# Altium project Task Tyler.PrjPcb (part 1 of 3)
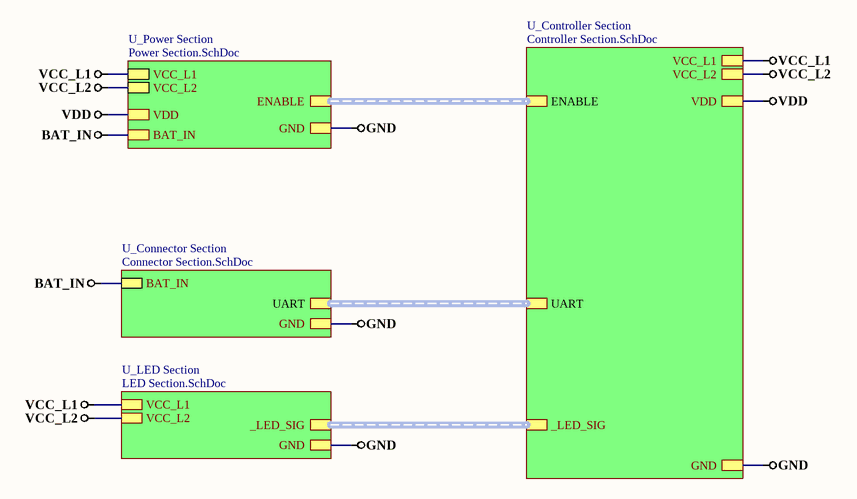
[diagram p0: Top Sheet.SchDoc]
33 sheets, 464 parts. Net scope: hierarchical (ports join the sheet entries above them; power ports are global).
Board files: Hotbuton_timer.PcbDoc, PCB_New.PcbDoc
Sheets:
  Top Sheet.SchDoc
    U_LED Section = LED Section.SchDoc
      U_Ring 1 = Ring 1.SchDoc
      U_Ring 2 = Ring 2.SchDoc
        U_Ring 2_A = Ring 2_A.SchDoc
        U_Ring 2_B = Ring 2_B.SchDoc
      U_Ring 3 = Ring 3.SchDoc
        U_Ring 3_B = Ring 3_B.SchDoc
        U_Ring 3_A = Ring 3_A.SchDoc
        U_Ring 3_C = Ring 3_C.SchDoc
      U_Ring 4 = Ring 4.SchDoc
        U_Ring 4_A = Ring 4_A.SchDoc
        U_Ring 4_B = Ring 4_B.SchDoc
        U_Ring 4_C = Ring 4_C.SchDoc
      U_Ring 5 = Ring 5.SchDoc
        U_Ring 5_A = Ring 5_A.SchDoc
        U_Ring 5_B = Ring 5_B.SchDoc
        U_Ring 5_C = Ring 5_C.SchDoc
        U_Ring 5_D = Ring 5_D.SchDoc
      U_Decoup_Cap 1 = Decoup_Cap 1.SchDoc
      U_Decoup_Cap 2 = Decoup_Cap 2.SchDoc
    U_Power Section = Power Section.SchDoc
      U_MCU_POWER = MCU_POWER.SchDoc
      U_LED_POWER = LED_POWER.SchDoc
      U_POWER_SWITCH = POWER_SWITCH.SchDoc
      U_SEC_POWER = SEC_POWER.SchDoc
      U_LED_POWER 2 = LED_POWER 2.SchDoc
    U_Controller Section = Controller Section.SchDoc
      U_MAIN_CONN = MAIN_CONN.SchDoc
      U_SOUND_SEC = SOUND_SEC.SchDoc
      U_LED_CONV_SIG = LED_CONV_SIG.SchDoc
      U_RTC_SEC = RTC_SEC.SchDoc
    U_Connector Section = Connector Section.SchDoc

## Sheet Top Sheet.SchDoc
size A; DocumentNumber: 1; SheetNumber: 1; SheetTotal: 30

### Sub-sheets
U_Connector Section = Connector Section.SchDoc: UART (harness Harness), BAT_IN, GND
U_Controller Section = Controller Section.SchDoc: ENABLE (harness Harness_2), UART (harness Harness), VCC_L2, VCC_L1, VDD, GND, _LED_SIG (harness Harness_8)
U_LED Section = LED Section.SchDoc: GND, VCC_L2, VCC_L1, _LED_SIG (harness Harness_8)
U_Power Section = Power Section.SchDoc: VCC_L1, VCC_L2, VDD, GND, ENABLE (harness Harness_2), BAT_IN

### Nets
BAT_IN: sheet U_Power Section/BAT_IN, sheet U_Connector Section/BAT_IN
GND: sheet U_LED Section/GND, sheet U_Power Section/GND, sheet U_Controller Section/GND, sheet U_Connector Section/GND
VCC_L1: sheet U_LED Section/VCC_L1, sheet U_Power Section/VCC_L1, sheet U_Controller Section/VCC_L1
VCC_L2: sheet U_LED Section/VCC_L2, sheet U_Power Section/VCC_L2, sheet U_Controller Section/VCC_L2
VDD: sheet U_Power Section/VDD, sheet U_Controller Section/VDD

### Buses and harness runs
harness sheet U_Connector Section/UART = sheet U_Controller Section/UART
harness sheet U_Controller Section/_LED_SIG = sheet U_LED Section/_LED_SIG
harness sheet U_Controller Section/ENABLE = sheet U_Power Section/ENABLE

## Sheet LED Section.SchDoc
size A; DocumentNumber: 6; SheetNumber: 8; SheetTotal: 30
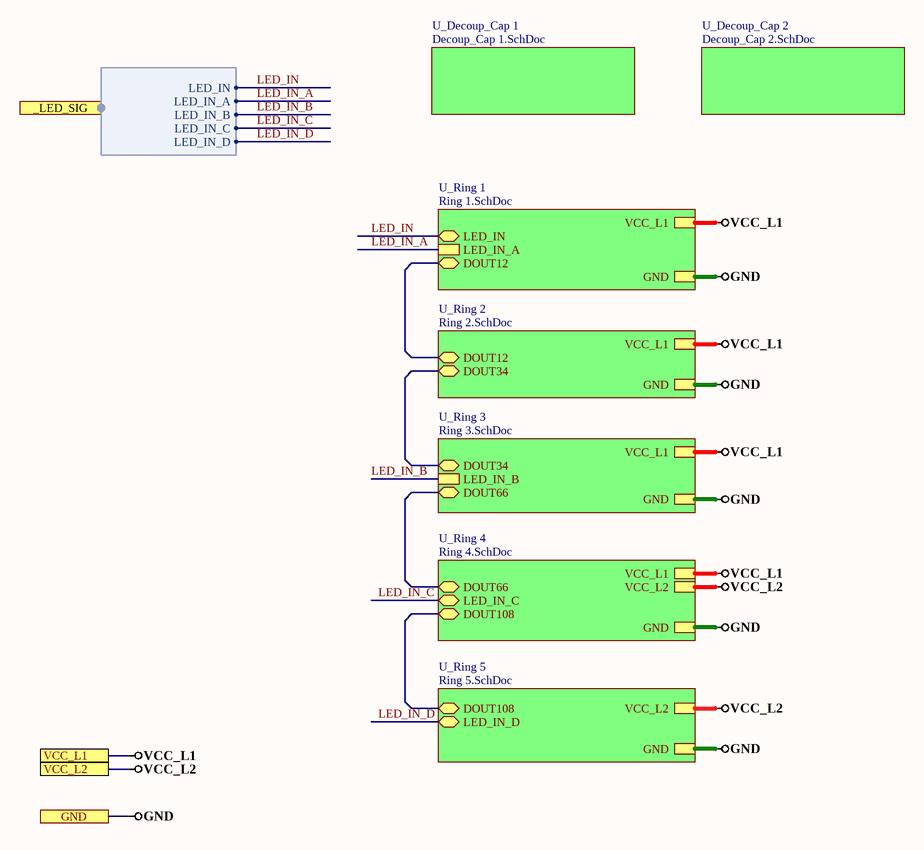
[diagram p1: LED Section.SchDoc]

### Sub-sheets
U_Decoup_Cap 1 = Decoup_Cap 1.SchDoc: no entries
U_Decoup_Cap 2 = Decoup_Cap 2.SchDoc: no entries
U_Ring 1 = Ring 1.SchDoc: DOUT12 (bidir), LED_IN (bidir), LED_IN_A, GND, VCC_L1
U_Ring 2 = Ring 2.SchDoc: DOUT12 (bidir), DOUT34 (bidir), GND, VCC_L1
U_Ring 3 = Ring 3.SchDoc: DOUT34 (bidir), DOUT66 (bidir), GND, VCC_L1, LED_IN_B
U_Ring 4 = Ring 4.SchDoc: DOUT108 (bidir), DOUT66 (bidir), GND, VCC_L2, VCC_L1, LED_IN_C (bidir)
U_Ring 5 = Ring 5.SchDoc: DOUT108 (bidir), GND, VCC_L2, LED_IN_D (bidir)

### Ports
_LED_SIG (harness Harness_8), GND, VCC_L1, VCC_L2

### Harnesses
Harness_8: LED_IN, LED_IN_A, LED_IN_B, LED_IN_C, LED_IN_D

### Nets
GND: port GND, sheet U_Ring 1/GND, sheet U_Ring 2/GND, sheet U_Ring 3/GND, sheet U_Ring 4/GND, sheet U_Ring 5/GND
VCC_L1: port VCC_L1, sheet U_Ring 1/VCC_L1, sheet U_Ring 2/VCC_L1, sheet U_Ring 3/VCC_L1, sheet U_Ring 4/VCC_L1
VCC_L2: port VCC_L2, sheet U_Ring 4/VCC_L2, sheet U_Ring 5/VCC_L2
DOUT12: sheet U_Ring 1/DOUT12, sheet U_Ring 2/DOUT12
DOUT34: sheet U_Ring 2/DOUT34, sheet U_Ring 3/DOUT34
DOUT66: sheet U_Ring 3/DOUT66, sheet U_Ring 4/DOUT66
DOUT108: sheet U_Ring 4/DOUT108, sheet U_Ring 5/DOUT108
LED_IN: sheet U_Ring 1/LED_IN, port _LED_SIG.LED_IN
LED_IN_A: sheet U_Ring 1/LED_IN_A, port _LED_SIG.LED_IN_A
LED_IN_B: sheet U_Ring 3/LED_IN_B, port _LED_SIG.LED_IN_B
LED_IN_C: sheet U_Ring 4/LED_IN_C, port _LED_SIG.LED_IN_C
LED_IN_D: sheet U_Ring 5/LED_IN_D, port _LED_SIG.LED_IN_D

## Sheet Ring 1.SchDoc
size A; DocumentNumber: 7; SheetNumber: 9; SheetTotal: 30
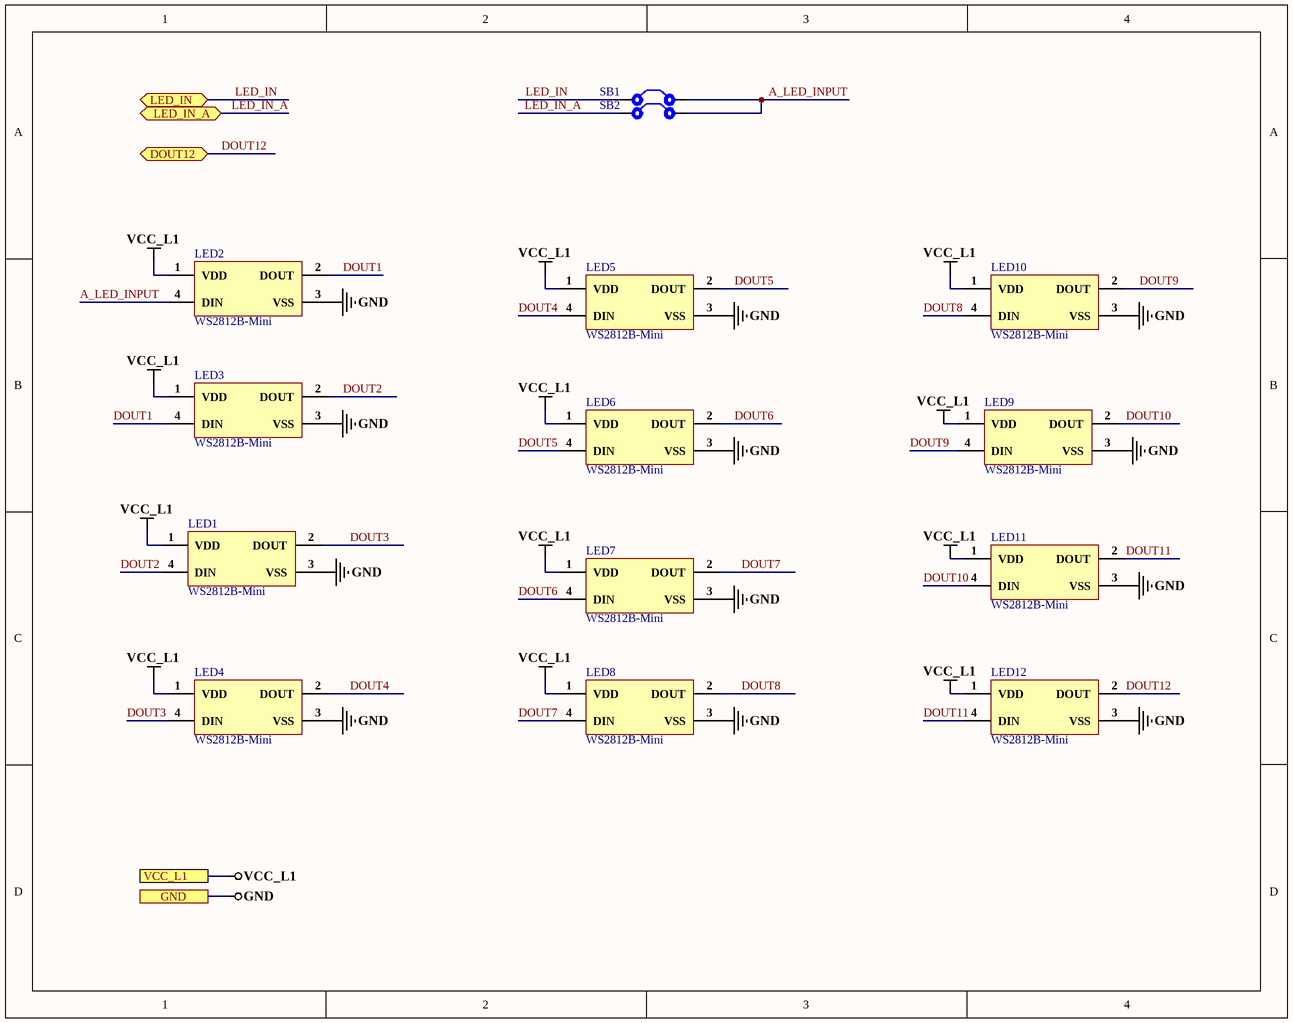
[diagram p2: Ring 1.SchDoc]

### Parts
LED1  WS2812B-Mini  [WS2812B-Mini]
LED2  WS2812B-Mini  [WS2812B-Mini]
LED3  WS2812B-Mini  [WS2812B-Mini]
LED4  WS2812B-Mini  [WS2812B-Mini]
LED5  WS2812B-Mini  [WS2812B-Mini]
LED6  WS2812B-Mini  [WS2812B-Mini]
LED7  WS2812B-Mini  [WS2812B-Mini]
LED8  WS2812B-Mini  [WS2812B-Mini]
LED9  WS2812B-Mini  [WS2812B-Mini]
LED10  WS2812B-Mini  [WS2812B-Mini]
LED11  WS2812B-Mini  [WS2812B-Mini]
LED12  WS2812B-Mini  [WS2812B-Mini]
SB1  Solder Bridge  [Solder Bridge]  (value not drawn)
SB2  Solder Bridge  [Solder Bridge]  (value not drawn)

### Ports
DOUT12 (bidir), GND, LED_IN (bidir), LED_IN_A (bidir), VCC_L1

### Nets
GND: LED1.3(VSS) LED2.3(VSS) LED3.3(VSS) LED4.3(VSS) LED5.3(VSS) LED6.3(VSS) LED7.3(VSS) LED8.3(VSS) LED9.3(VSS) LED10.3(VSS) LED11.3(VSS) LED12.3(VSS) ; port GND
VCC_L1: LED1.1(VDD) LED2.1(VDD) LED3.1(VDD) LED4.1(VDD) LED5.1(VDD) LED6.1(VDD) LED7.1(VDD) LED8.1(VDD) LED9.1(VDD) LED10.1(VDD) LED11.1(VDD) LED12.1(VDD) ; port VCC_L1
A_LED_INPUT: LED2.4(DIN) SB1.2 SB2.2
DOUT1: LED2.2(DOUT) LED3.4(DIN)
DOUT2: LED1.4(DIN) LED3.2(DOUT)
DOUT3: LED1.2(DOUT) LED4.4(DIN)
DOUT4: LED4.2(DOUT) LED5.4(DIN)
DOUT5: LED5.2(DOUT) LED6.4(DIN)
DOUT6: LED6.2(DOUT) LED7.4(DIN)
DOUT7: LED7.2(DOUT) LED8.4(DIN)
DOUT8: LED8.2(DOUT) LED10.4(DIN)
DOUT9: LED9.4(DIN) LED10.2(DOUT)
DOUT10: LED9.2(DOUT) LED11.4(DIN)
DOUT11: LED11.2(DOUT) LED12.4(DIN)
DOUT12: LED12.2(DOUT) ; port DOUT12
LED_IN: SB1.1 ; port LED_IN
LED_IN_A: SB2.1 ; port LED_IN_A

### Library data of the parts
LED1-LED12 = WS2812B-Mini: SMD,3.5x3.5mm Light Emitting Diodes (LED) RoHS; Manufacturer: Worldsemi; ComponentLink1Description: LCSC; ComponentLink1URL: *https://lcsc.com/product-detail/Light-Emitting-Diodes-LED_Worldsemi-WS2812B-Mini_C527089.html; Package: SMD,3.5x3.5mm; Parameter 1: *
SB1 SB2 = Solder Bridge: Solder Bridge ON

## Sheet Ring 2.SchDoc
size A; SheetNumber: 10; SheetTotal: 30
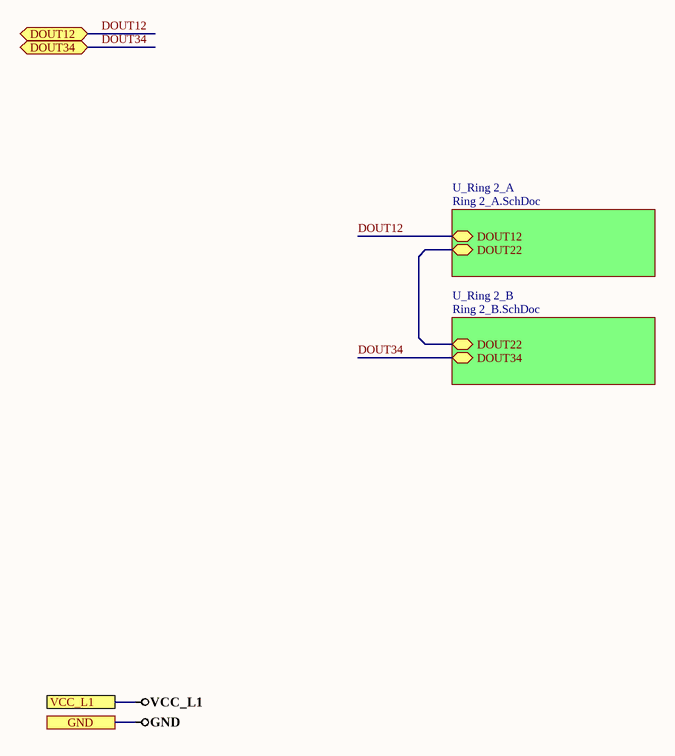
[diagram p3: Ring 2.SchDoc]

### Sub-sheets
U_Ring 2_A = Ring 2_A.SchDoc: DOUT22 (bidir), DOUT12 (bidir)
U_Ring 2_B = Ring 2_B.SchDoc: DOUT22 (bidir), DOUT34 (bidir)

### Ports
DOUT12 (bidir), DOUT34 (bidir), GND, VCC_L1

### Nets
DOUT12: port DOUT12, sheet U_Ring 2_A/DOUT12
DOUT22: sheet U_Ring 2_A/DOUT22, sheet U_Ring 2_B/DOUT22
DOUT34: port DOUT34, sheet U_Ring 2_B/DOUT34

## Sheet Ring 2_A.SchDoc
size A; SheetNumber: 11; SheetTotal: 30
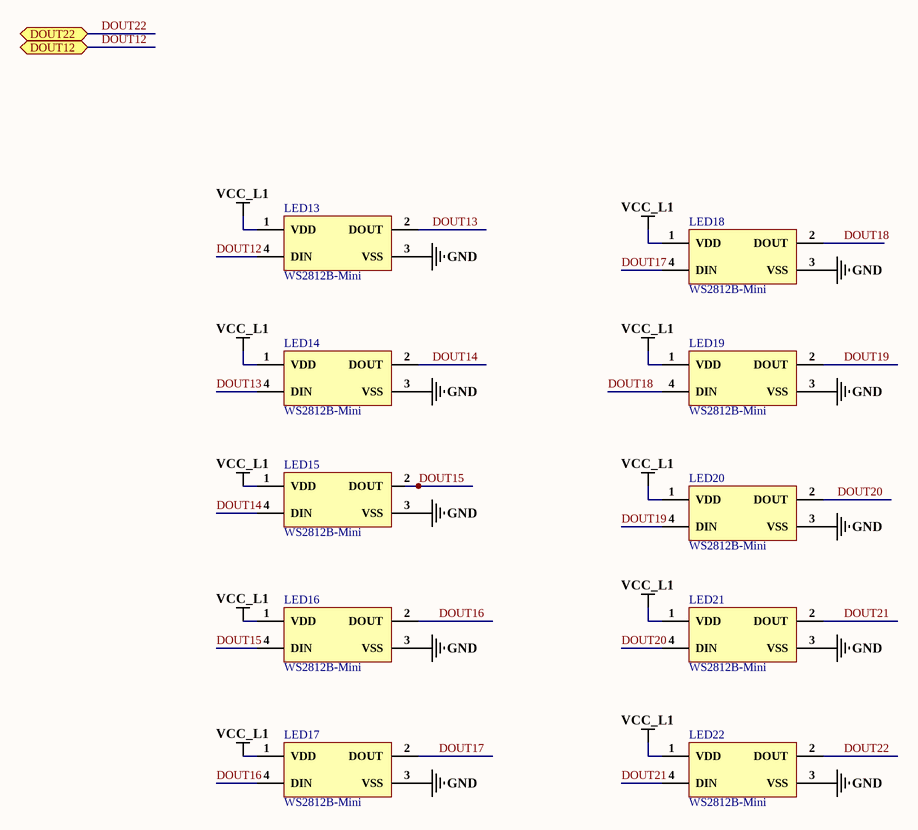
[diagram p4: Ring 2_A.SchDoc]

### Parts
LED13  WS2812B-Mini  [WS2812B-Mini]
LED14  WS2812B-Mini  [WS2812B-Mini]
LED15  WS2812B-Mini  [WS2812B-Mini]
LED16  WS2812B-Mini  [WS2812B-Mini]
LED17  WS2812B-Mini  [WS2812B-Mini]
LED18  WS2812B-Mini  [WS2812B-Mini]
LED19  WS2812B-Mini  [WS2812B-Mini]
LED20  WS2812B-Mini  [WS2812B-Mini]
LED21  WS2812B-Mini  [WS2812B-Mini]
LED22  WS2812B-Mini  [WS2812B-Mini]

### Ports
DOUT12 (bidir), DOUT22 (bidir)

### Nets
GND: LED13.3(VSS) LED14.3(VSS) LED15.3(VSS) LED16.3(VSS) LED17.3(VSS) LED18.3(VSS) LED19.3(VSS) LED20.3(VSS) LED21.3(VSS) LED22.3(VSS)
VCC_L1: LED13.1(VDD) LED14.1(VDD) LED15.1(VDD) LED16.1(VDD) LED17.1(VDD) LED18.1(VDD) LED19.1(VDD) LED20.1(VDD) LED21.1(VDD) LED22.1(VDD)
DOUT12: LED13.4(DIN) ; port DOUT12
DOUT13: LED13.2(DOUT) LED14.4(DIN)
DOUT14: LED14.2(DOUT) LED15.4(DIN)
DOUT15: LED15.2(DOUT) LED16.4(DIN)
DOUT16: LED16.2(DOUT) LED17.4(DIN)
DOUT17: LED17.2(DOUT) LED18.4(DIN)
DOUT18: LED18.2(DOUT) LED19.4(DIN)
DOUT19: LED19.2(DOUT) LED20.4(DIN)
DOUT20: LED20.2(DOUT) LED21.4(DIN)
DOUT21: LED21.2(DOUT) LED22.4(DIN)
DOUT22: LED22.2(DOUT) ; port DOUT22

### Library data of the parts
LED13-LED22 = WS2812B-Mini: as LED1 on sheet Ring 1; ComponentLink1Description: LCSC; ComponentLink1URL: *https://lcsc.com/product-detail/Light-Emitting-Diodes-LED_Worldsemi-WS2812B-Mini_C527089.html; Package: SMD,3.5x3.5mm; Parameter 1: *

## Sheet Ring 2_B.SchDoc
size A; DocumentNumber: 8; SheetNumber: 12; SheetTotal: 30
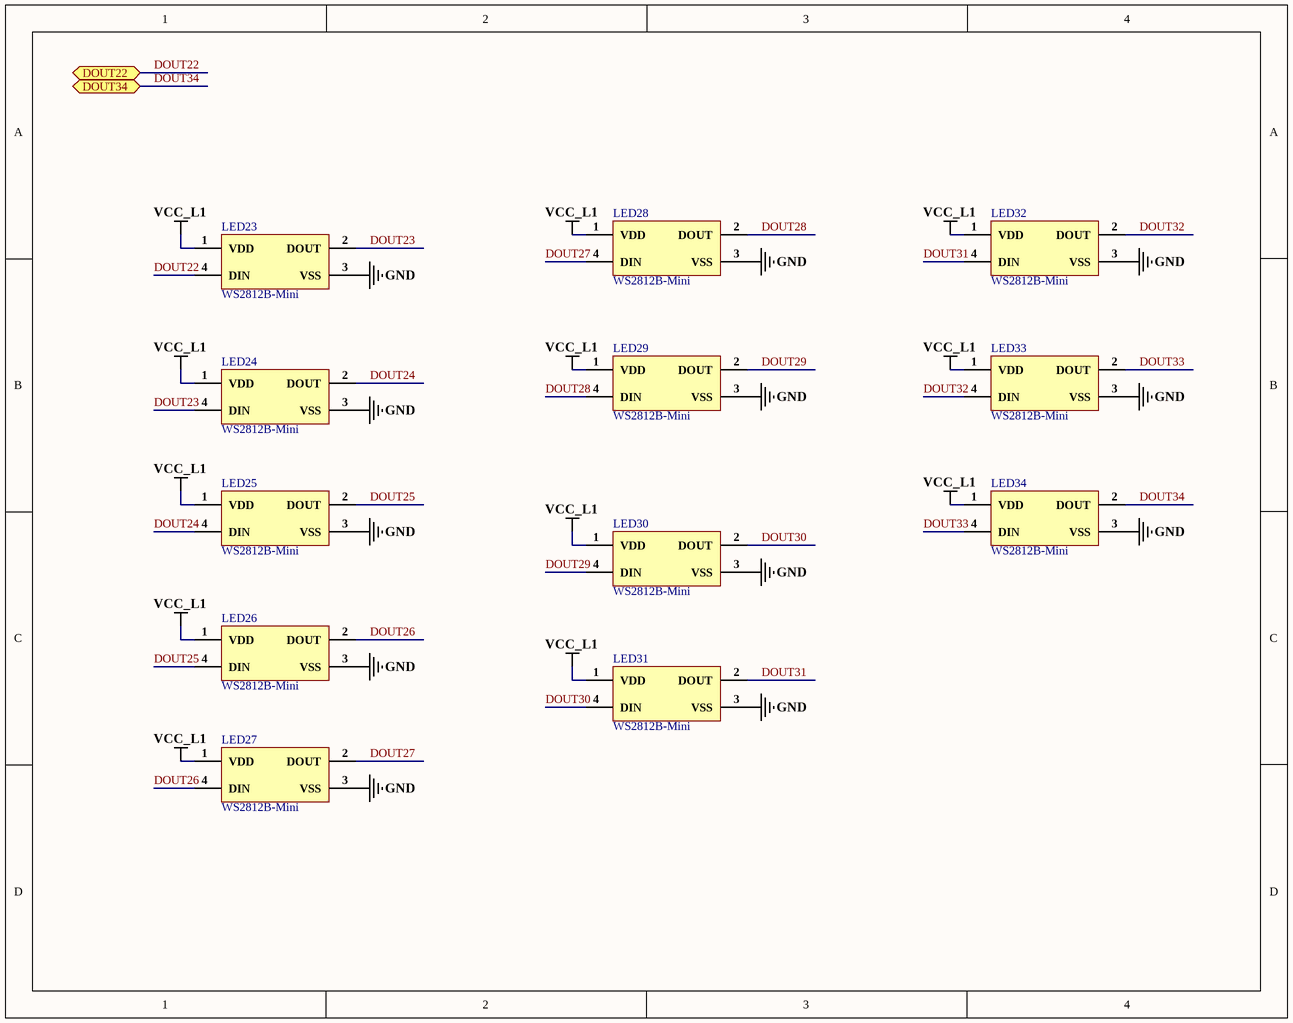
[diagram p5: Ring 2_B.SchDoc]

### Parts
LED23  WS2812B-Mini  [WS2812B-Mini]
LED24  WS2812B-Mini  [WS2812B-Mini]
LED25  WS2812B-Mini  [WS2812B-Mini]
LED26  WS2812B-Mini  [WS2812B-Mini]
LED27  WS2812B-Mini  [WS2812B-Mini]
LED28  WS2812B-Mini  [WS2812B-Mini]
LED29  WS2812B-Mini  [WS2812B-Mini]
LED30  WS2812B-Mini  [WS2812B-Mini]
LED31  WS2812B-Mini  [WS2812B-Mini]
LED32  WS2812B-Mini  [WS2812B-Mini]
LED33  WS2812B-Mini  [WS2812B-Mini]
LED34  WS2812B-Mini  [WS2812B-Mini]

### Ports
DOUT22 (bidir), DOUT34 (bidir)

### Nets
GND: LED23.3(VSS) LED24.3(VSS) LED25.3(VSS) LED26.3(VSS) LED27.3(VSS) LED28.3(VSS) LED29.3(VSS) LED30.3(VSS) LED31.3(VSS) LED32.3(VSS) LED33.3(VSS) LED34.3(VSS)
VCC_L1: LED23.1(VDD) LED24.1(VDD) LED25.1(VDD) LED26.1(VDD) LED27.1(VDD) LED28.1(VDD) LED29.1(VDD) LED30.1(VDD) LED31.1(VDD) LED32.1(VDD) LED33.1(VDD) LED34.1(VDD)
DOUT22: LED23.4(DIN) ; port DOUT22
DOUT23: LED23.2(DOUT) LED24.4(DIN)
DOUT24: LED24.2(DOUT) LED25.4(DIN)
DOUT25: LED25.2(DOUT) LED26.4(DIN)
DOUT26: LED26.2(DOUT) LED27.4(DIN)
DOUT27: LED27.2(DOUT) LED28.4(DIN)
DOUT28: LED28.2(DOUT) LED29.4(DIN)
DOUT29: LED29.2(DOUT) LED30.4(DIN)
DOUT30: LED30.2(DOUT) LED31.4(DIN)
DOUT31: LED31.2(DOUT) LED32.4(DIN)
DOUT32: LED32.2(DOUT) LED33.4(DIN)
DOUT33: LED33.2(DOUT) LED34.4(DIN)
DOUT34: LED34.2(DOUT) ; port DOUT34

### Library data of the parts
LED23-LED34 = WS2812B-Mini: as LED1 on sheet Ring 1; ComponentLink1Description: LCSC; ComponentLink1URL: *https://lcsc.com/product-detail/Light-Emitting-Diodes-LED_Worldsemi-WS2812B-Mini_C527089.html; Package: SMD,3.5x3.5mm; Parameter 1: *

## Sheet Ring 3.SchDoc
size A; SheetNumber: 13; SheetTotal: 30
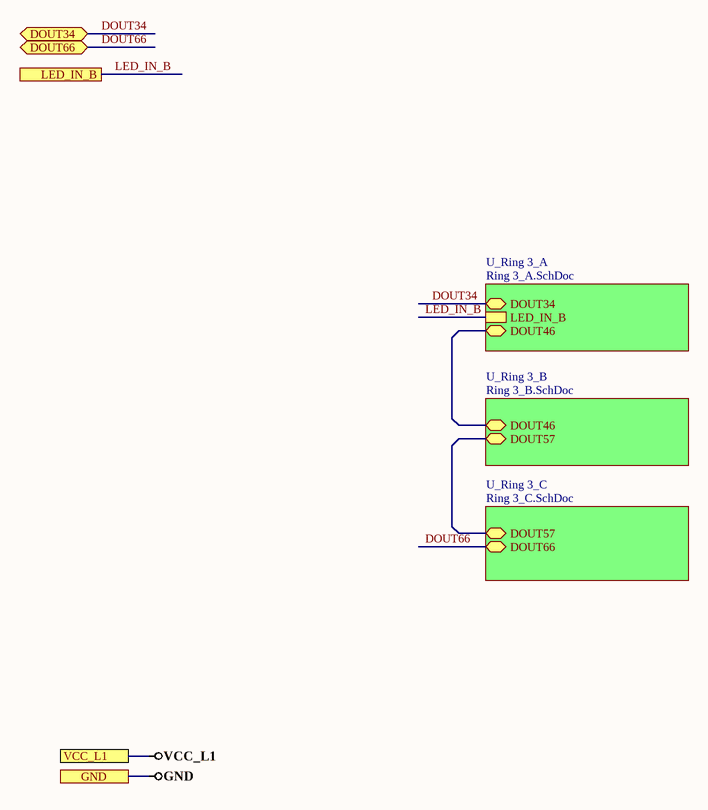
[diagram p6: Ring 3.SchDoc]

### Sub-sheets
U_Ring 3_A = Ring 3_A.SchDoc: DOUT34 (bidir), DOUT46 (bidir), LED_IN_B
U_Ring 3_B = Ring 3_B.SchDoc: DOUT57 (bidir), DOUT46 (bidir)
U_Ring 3_C = Ring 3_C.SchDoc: DOUT66 (bidir), DOUT57 (bidir)

### Ports
DOUT34 (bidir), DOUT66 (bidir), GND, LED_IN_B, VCC_L1

### Nets
DOUT34: port DOUT34, sheet U_Ring 3_A/DOUT34
DOUT46: sheet U_Ring 3_B/DOUT46, sheet U_Ring 3_A/DOUT46
DOUT57: sheet U_Ring 3_B/DOUT57, sheet U_Ring 3_C/DOUT57
DOUT66: port DOUT66, sheet U_Ring 3_C/DOUT66
LED_IN_B: port LED_IN_B, sheet U_Ring 3_A/LED_IN_B

## Sheet Ring 3_B.SchDoc
size A; SheetNumber: 15; SheetTotal: 30
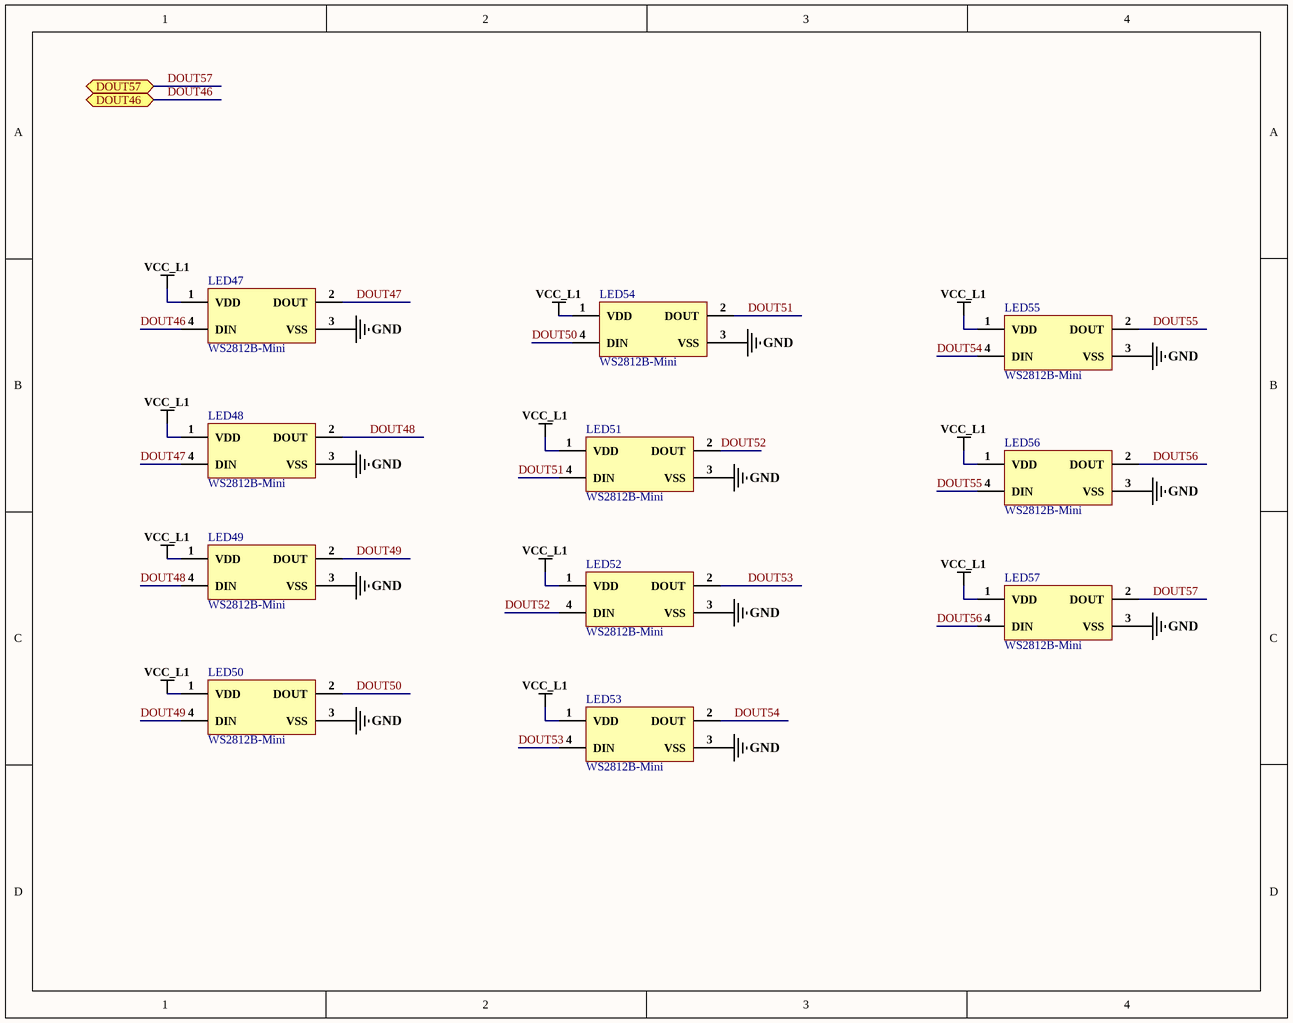
[diagram p7: Ring 3_B.SchDoc]

### Parts
LED47  WS2812B-Mini  [WS2812B-Mini]
LED48  WS2812B-Mini  [WS2812B-Mini]
LED49  WS2812B-Mini  [WS2812B-Mini]
LED50  WS2812B-Mini  [WS2812B-Mini]
LED51  WS2812B-Mini  [WS2812B-Mini]
LED52  WS2812B-Mini  [WS2812B-Mini]
LED53  WS2812B-Mini  [WS2812B-Mini]
LED54  WS2812B-Mini  [WS2812B-Mini]
LED55  WS2812B-Mini  [WS2812B-Mini]
LED56  WS2812B-Mini  [WS2812B-Mini]
LED57  WS2812B-Mini  [WS2812B-Mini]

### Ports
DOUT46 (bidir), DOUT57 (bidir)

### Nets
GND: LED47.3(VSS) LED48.3(VSS) LED49.3(VSS) LED50.3(VSS) LED51.3(VSS) LED52.3(VSS) LED53.3(VSS) LED54.3(VSS) LED55.3(VSS) LED56.3(VSS) LED57.3(VSS)
VCC_L1: LED47.1(VDD) LED48.1(VDD) LED49.1(VDD) LED50.1(VDD) LED51.1(VDD) LED52.1(VDD) LED53.1(VDD) LED54.1(VDD) LED55.1(VDD) LED56.1(VDD) LED57.1(VDD)
DOUT46: LED47.4(DIN) ; port DOUT46
DOUT47: LED47.2(DOUT) LED48.4(DIN)
DOUT48: LED48.2(DOUT) LED49.4(DIN)
DOUT49: LED49.2(DOUT) LED50.4(DIN)
DOUT50: LED50.2(DOUT) LED54.4(DIN)
DOUT51: LED51.4(DIN) LED54.2(DOUT)
DOUT52: LED51.2(DOUT) LED52.4(DIN)
DOUT53: LED52.2(DOUT) LED53.4(DIN)
DOUT54: LED53.2(DOUT) LED55.4(DIN)
DOUT55: LED55.2(DOUT) LED56.4(DIN)
DOUT56: LED56.2(DOUT) LED57.4(DIN)
DOUT57: LED57.2(DOUT) ; port DOUT57

### Library data of the parts
LED47-LED57 = WS2812B-Mini: as LED1 on sheet Ring 1; ComponentLink1Description: LCSC; ComponentLink1URL: *https://lcsc.com/product-detail/Light-Emitting-Diodes-LED_Worldsemi-WS2812B-Mini_C527089.html; Package: SMD,3.5x3.5mm; Parameter 1: *

## Sheet Ring 3_A.SchDoc
size A; DocumentNumber: 9; SheetNumber: 14; SheetTotal: 30
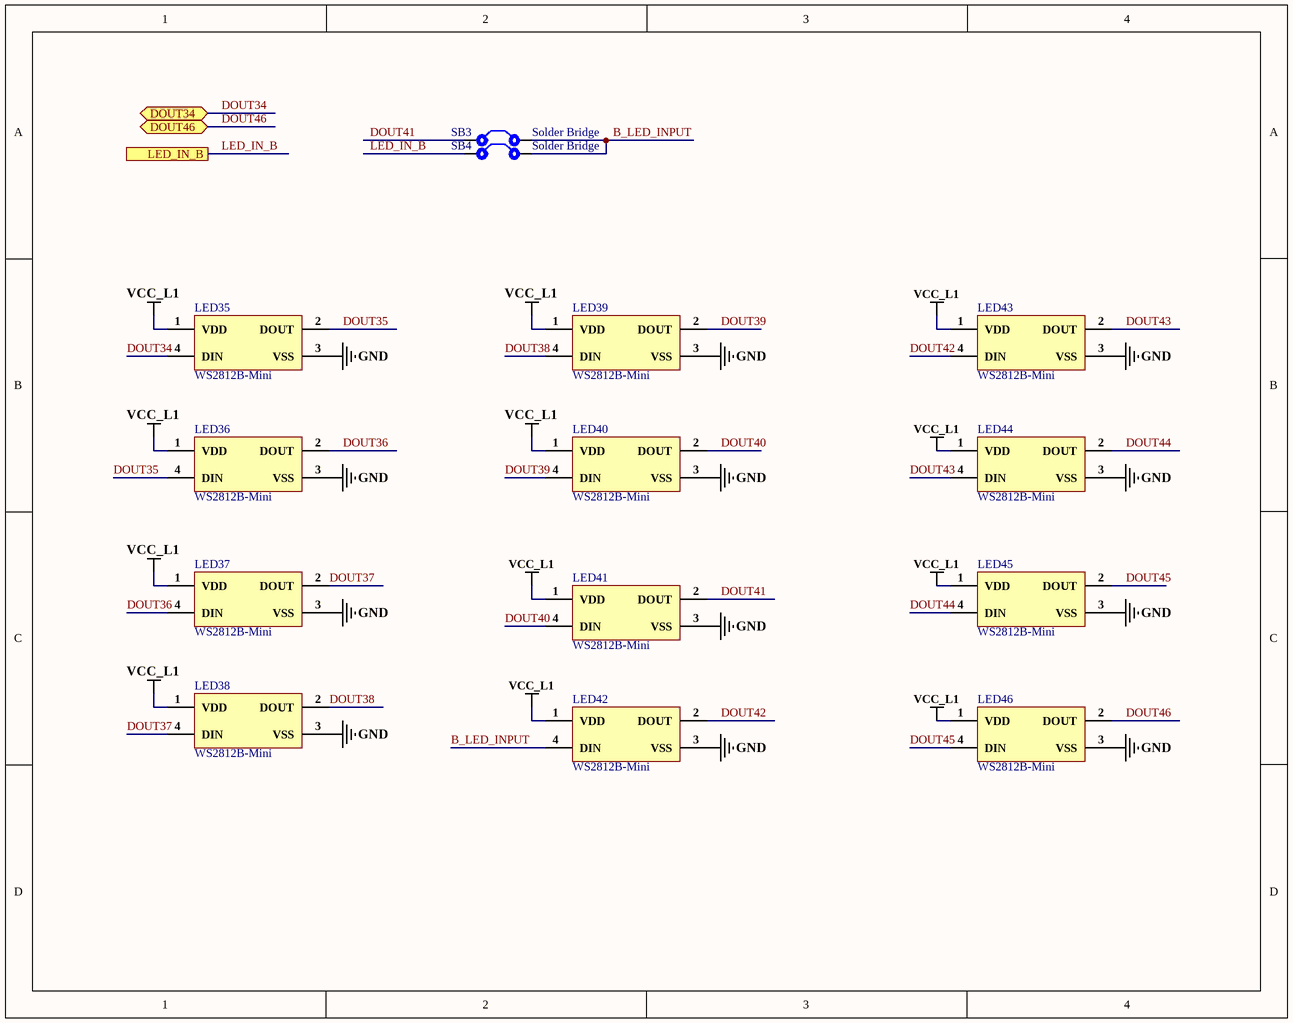
[diagram p8: Ring 3_A.SchDoc]

### Parts
(Parts that share a designator on the sheet are numbered #1, #2 ... from top to bottom, then left to right.)
LED35  WS2812B-Mini  [WS2812B-Mini]
LED36  WS2812B-Mini  [WS2812B-Mini]
LED37  WS2812B-Mini  [WS2812B-Mini]
LED38  WS2812B-Mini  [WS2812B-Mini]
LED39  WS2812B-Mini  [WS2812B-Mini]
LED40  WS2812B-Mini  [WS2812B-Mini]
LED41  WS2812B-Mini  [WS2812B-Mini]
LED42  WS2812B-Mini  [WS2812B-Mini]
LED43  WS2812B-Mini  [WS2812B-Mini]
LED44  WS2812B-Mini  [WS2812B-Mini]
LED45  WS2812B-Mini  [WS2812B-Mini]
LED46  WS2812B-Mini  [WS2812B-Mini]
SB3#1  Solder Bridge  [Solder Bridge]
SB4#1  Solder Bridge  [Solder Bridge]

### Ports
DOUT34 (bidir), DOUT46 (bidir), LED_IN_B

### Nets
GND: LED35.3(VSS) LED36.3(VSS) LED37.3(VSS) LED38.3(VSS) LED39.3(VSS) LED40.3(VSS) LED41.3(VSS) LED42.3(VSS) LED43.3(VSS) LED44.3(VSS) LED45.3(VSS) LED46.3(VSS)
VCC_L1: LED35.1(VDD) LED36.1(VDD) LED37.1(VDD) LED38.1(VDD) LED39.1(VDD) LED40.1(VDD) LED41.1(VDD) LED42.1(VDD) LED43.1(VDD) LED44.1(VDD) LED45.1(VDD) LED46.1(VDD)
B_LED_INPUT: LED42.4(DIN) SB3#1.2 SB4#1.2
DOUT34: LED35.4(DIN) ; port DOUT34
DOUT35: LED35.2(DOUT) LED36.4(DIN)
DOUT36: LED36.2(DOUT) LED37.4(DIN)
DOUT37: LED37.2(DOUT) LED38.4(DIN)
DOUT38: LED38.2(DOUT) LED39.4(DIN)
DOUT39: LED39.2(DOUT) LED40.4(DIN)
DOUT40: LED40.2(DOUT) LED41.4(DIN)
DOUT41: LED41.2(DOUT) SB3#1.1
DOUT42: LED42.2(DOUT) LED43.4(DIN)
DOUT43: LED43.2(DOUT) LED44.4(DIN)
DOUT44: LED44.2(DOUT) LED45.4(DIN)
DOUT45: LED45.2(DOUT) LED46.4(DIN)
DOUT46: LED46.2(DOUT) ; port DOUT46
LED_IN_B: SB4#1.1 ; port LED_IN_B

### Library data of the parts
LED35-LED46 = WS2812B-Mini: as LED1 on sheet Ring 1; ComponentLink1Description: LCSC; ComponentLink1URL: *https://lcsc.com/product-detail/Light-Emitting-Diodes-LED_Worldsemi-WS2812B-Mini_C527089.html; Package: SMD,3.5x3.5mm; Parameter 1: *
SB3#1 SB4#1 = Solder Bridge: Solder Bridge ON

## Sheet Ring 3_C.SchDoc
size A; DocumentNumber: 10; SheetNumber: 16; SheetTotal: 30
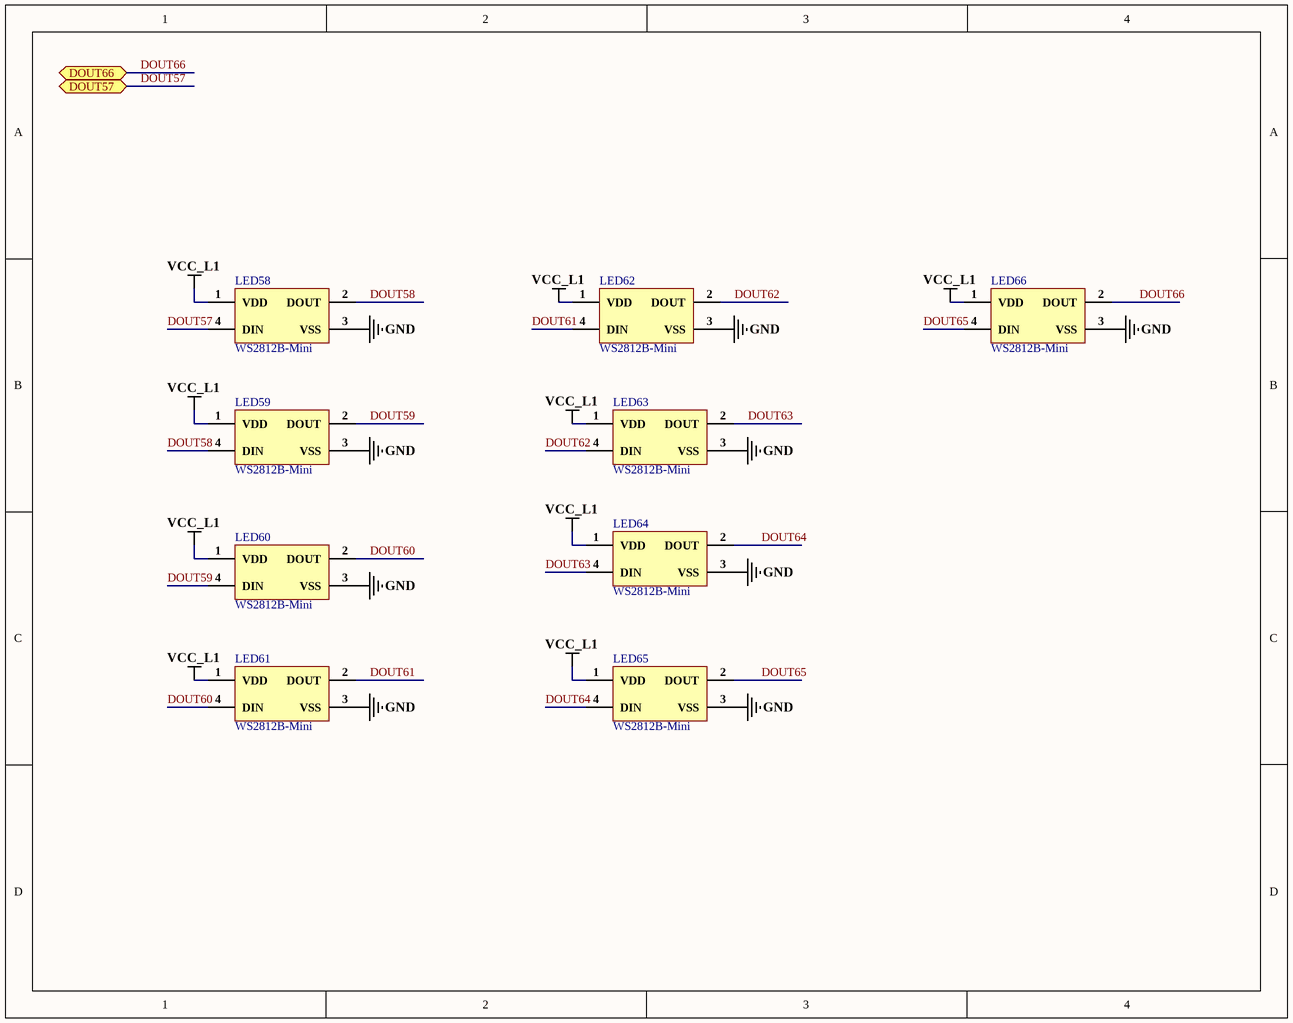
[diagram p9: Ring 3_C.SchDoc]

### Parts
LED58  WS2812B-Mini  [WS2812B-Mini]
LED59  WS2812B-Mini  [WS2812B-Mini]
LED60  WS2812B-Mini  [WS2812B-Mini]
LED61  WS2812B-Mini  [WS2812B-Mini]
LED62  WS2812B-Mini  [WS2812B-Mini]
LED63  WS2812B-Mini  [WS2812B-Mini]
LED64  WS2812B-Mini  [WS2812B-Mini]
LED65  WS2812B-Mini  [WS2812B-Mini]
LED66  WS2812B-Mini  [WS2812B-Mini]

### Ports
DOUT57 (bidir), DOUT66 (bidir)

### Nets
GND: LED58.3(VSS) LED59.3(VSS) LED60.3(VSS) LED61.3(VSS) LED62.3(VSS) LED63.3(VSS) LED64.3(VSS) LED65.3(VSS) LED66.3(VSS)
VCC_L1: LED58.1(VDD) LED59.1(VDD) LED60.1(VDD) LED61.1(VDD) LED62.1(VDD) LED63.1(VDD) LED64.1(VDD) LED65.1(VDD) LED66.1(VDD)
DOUT57: LED58.4(DIN) ; port DOUT57
DOUT58: LED58.2(DOUT) LED59.4(DIN)
DOUT59: LED59.2(DOUT) LED60.4(DIN)
DOUT60: LED60.2(DOUT) LED61.4(DIN)
DOUT61: LED61.2(DOUT) LED62.4(DIN)
DOUT62: LED62.2(DOUT) LED63.4(DIN)
DOUT63: LED63.2(DOUT) LED64.4(DIN)
DOUT64: LED64.2(DOUT) LED65.4(DIN)
DOUT65: LED65.2(DOUT) LED66.4(DIN)
DOUT66: LED66.2(DOUT) ; port DOUT66

### Library data of the parts
LED58-LED66 = WS2812B-Mini: as LED1 on sheet Ring 1; ComponentLink1Description: LCSC; ComponentLink1URL: *https://lcsc.com/product-detail/Light-Emitting-Diodes-LED_Worldsemi-WS2812B-Mini_C527089.html; Package: SMD,3.5x3.5mm; Parameter 1: *

## Sheet Ring 4.SchDoc
size A; SheetNumber: 17; SheetTotal: 30
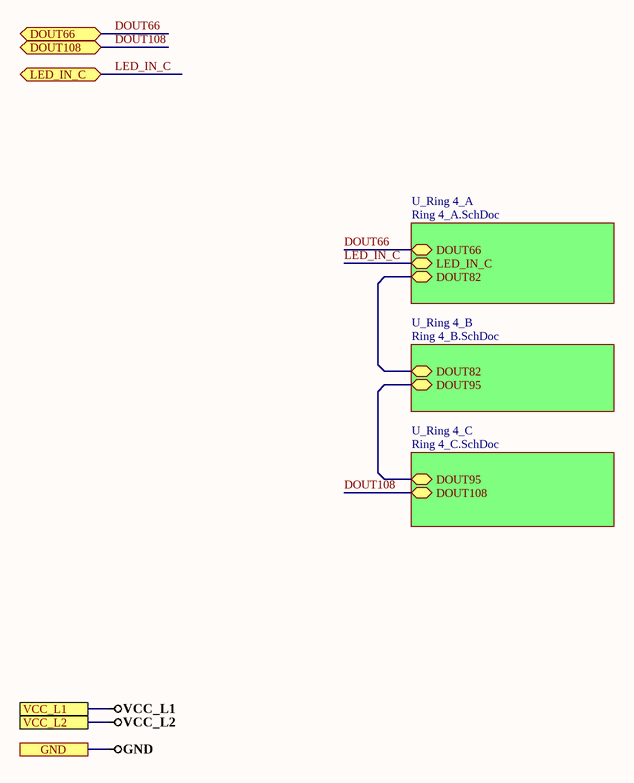
[diagram p10: Ring 4.SchDoc]

### Sub-sheets
U_Ring 4_A = Ring 4_A.SchDoc: DOUT66 (bidir), DOUT82 (bidir), LED_IN_C (bidir)
U_Ring 4_B = Ring 4_B.SchDoc: DOUT82 (bidir), DOUT95 (bidir)
U_Ring 4_C = Ring 4_C.SchDoc: DOUT95 (bidir), DOUT108 (bidir)

### Ports
DOUT66 (bidir), DOUT108 (bidir), GND, LED_IN_C (bidir), VCC_L1, VCC_L2

### Nets
DOUT66: port DOUT66, sheet U_Ring 4_A/DOUT66
DOUT82: sheet U_Ring 4_A/DOUT82, sheet U_Ring 4_B/DOUT82
DOUT95: sheet U_Ring 4_B/DOUT95, sheet U_Ring 4_C/DOUT95
DOUT108: port DOUT108, sheet U_Ring 4_C/DOUT108
LED_IN_C: port LED_IN_C, sheet U_Ring 4_A/LED_IN_C

## Sheet Ring 4_A.SchDoc
size A; SheetNumber: 18; SheetTotal: 30
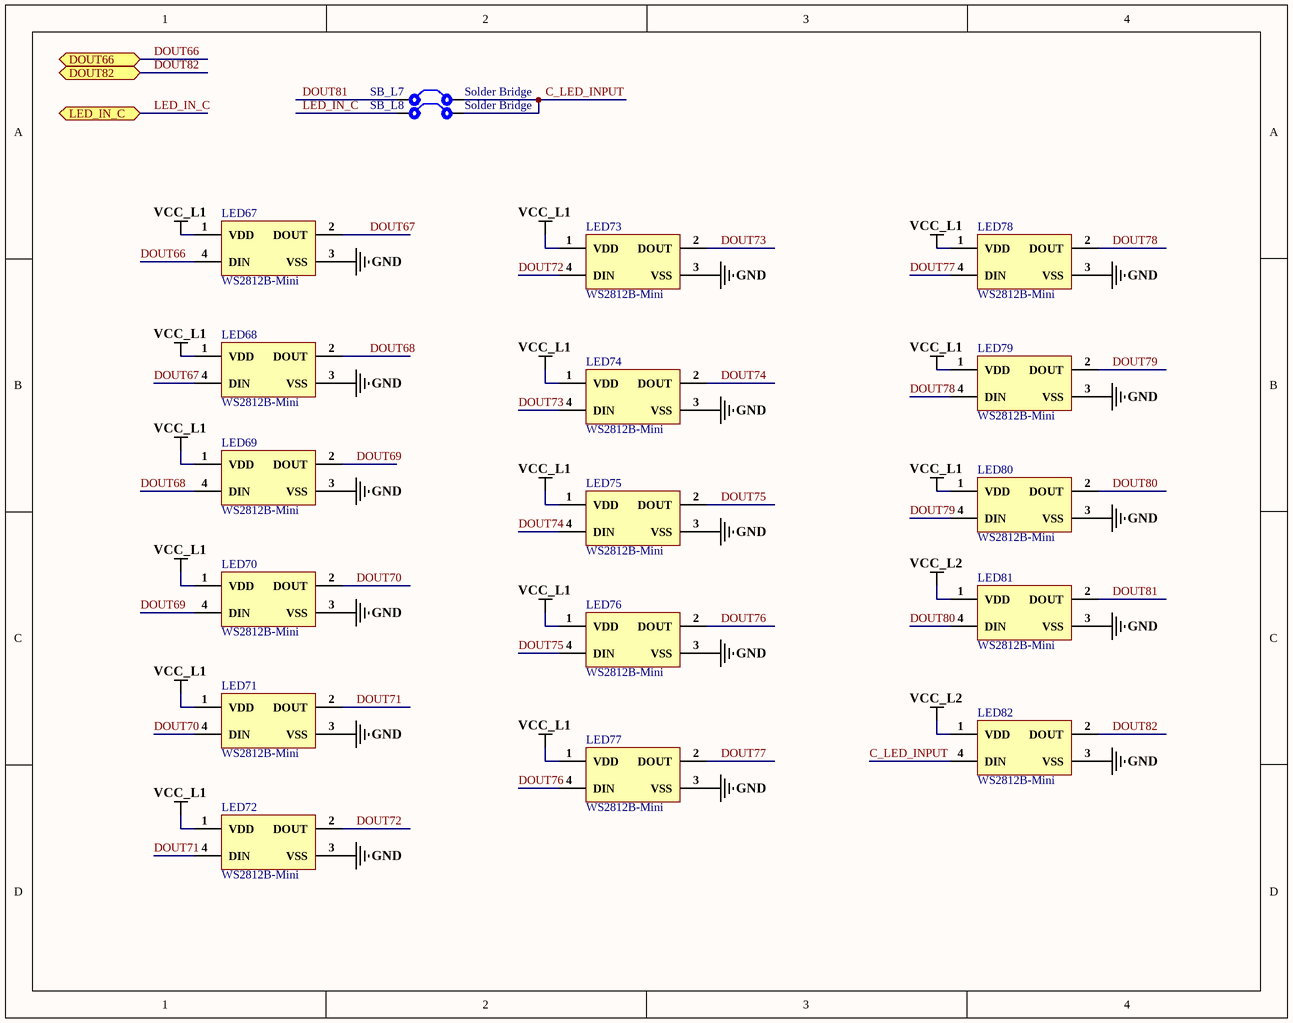
[diagram p11: Ring 4_A.SchDoc]

### Parts
LED67  WS2812B-Mini  [WS2812B-Mini]
LED68  WS2812B-Mini  [WS2812B-Mini]
LED69  WS2812B-Mini  [WS2812B-Mini]
LED70  WS2812B-Mini  [WS2812B-Mini]
LED71  WS2812B-Mini  [WS2812B-Mini]
LED72  WS2812B-Mini  [WS2812B-Mini]
LED73  WS2812B-Mini  [WS2812B-Mini]
LED74  WS2812B-Mini  [WS2812B-Mini]
LED75  WS2812B-Mini  [WS2812B-Mini]
LED76  WS2812B-Mini  [WS2812B-Mini]
LED77  WS2812B-Mini  [WS2812B-Mini]
LED78  WS2812B-Mini  [WS2812B-Mini]
LED79  WS2812B-Mini  [WS2812B-Mini]
LED80  WS2812B-Mini  [WS2812B-Mini]
LED81  WS2812B-Mini  [WS2812B-Mini]
LED82  WS2812B-Mini  [WS2812B-Mini]
SB_L7  Solder Bridge  [Solder Bridge]
SB_L8  Solder Bridge  [Solder Bridge]

### Ports
DOUT66 (bidir), DOUT82 (bidir), LED_IN_C (bidir)

### Nets
GND: LED67.3(VSS) LED68.3(VSS) LED69.3(VSS) LED70.3(VSS) LED71.3(VSS) LED72.3(VSS) LED73.3(VSS) LED74.3(VSS) LED75.3(VSS) LED76.3(VSS) LED77.3(VSS) LED78.3(VSS) LED79.3(VSS) LED80.3(VSS) LED81.3(VSS) LED82.3(VSS)
VCC_L1: LED67.1(VDD) LED68.1(VDD) LED69.1(VDD) LED70.1(VDD) LED71.1(VDD) LED72.1(VDD) LED73.1(VDD) LED74.1(VDD) LED75.1(VDD) LED76.1(VDD) LED77.1(VDD) LED78.1(VDD) LED79.1(VDD) LED80.1(VDD)
VCC_L2: LED81.1(VDD) LED82.1(VDD)
C_LED_INPUT: LED82.4(DIN) SB_L7.2 SB_L8.2
DOUT66: LED67.4(DIN) ; port DOUT66
DOUT67: LED67.2(DOUT) LED68.4(DIN)
DOUT68: LED68.2(DOUT) LED69.4(DIN)
DOUT69: LED69.2(DOUT) LED70.4(DIN)
DOUT70: LED70.2(DOUT) LED71.4(DIN)
DOUT71: LED71.2(DOUT) LED72.4(DIN)
DOUT72: LED72.2(DOUT) LED73.4(DIN)
DOUT73: LED73.2(DOUT) LED74.4(DIN)
DOUT74: LED74.2(DOUT) LED75.4(DIN)
DOUT75: LED75.2(DOUT) LED76.4(DIN)
DOUT76: LED76.2(DOUT) LED77.4(DIN)
DOUT77: LED77.2(DOUT) LED78.4(DIN)
DOUT78: LED78.2(DOUT) LED79.4(DIN)
DOUT79: LED79.2(DOUT) LED80.4(DIN)
DOUT80: LED80.2(DOUT) LED81.4(DIN)
DOUT81: LED81.2(DOUT) SB_L7.1
DOUT82: LED82.2(DOUT) ; port DOUT82
LED_IN_C: SB_L8.1 ; port LED_IN_C

### Library data of the parts
LED67-LED82 = WS2812B-Mini: as LED1 on sheet Ring 1; ComponentLink1Description: LCSC; ComponentLink1URL: *https://lcsc.com/product-detail/Light-Emitting-Diodes-LED_Worldsemi-WS2812B-Mini_C527089.html; Package: SMD,3.5x3.5mm; Parameter 1: *
SB_L7 SB_L8 = Solder Bridge: Solder Bridge ON

## Sheet Ring 4_B.SchDoc
size A; DocumentNumber: 11; SheetNumber: 19; SheetTotal: 30
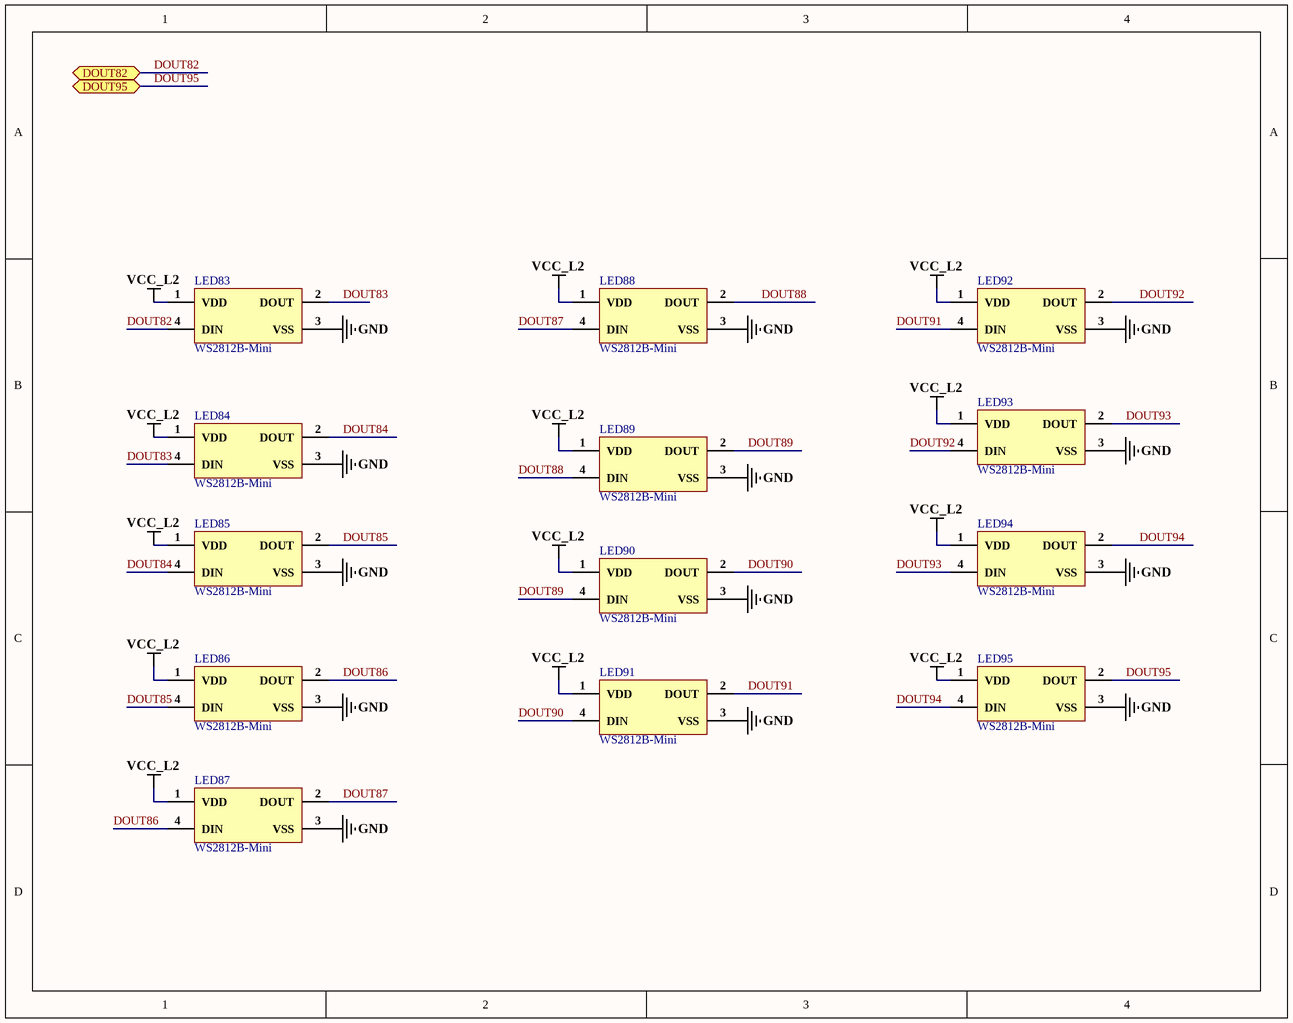
[diagram p12: Ring 4_B.SchDoc]

### Parts
LED83  WS2812B-Mini  [WS2812B-Mini]
LED84  WS2812B-Mini  [WS2812B-Mini]
LED85  WS2812B-Mini  [WS2812B-Mini]
LED86  WS2812B-Mini  [WS2812B-Mini]
LED87  WS2812B-Mini  [WS2812B-Mini]
LED88  WS2812B-Mini  [WS2812B-Mini]
LED89  WS2812B-Mini  [WS2812B-Mini]
LED90  WS2812B-Mini  [WS2812B-Mini]
LED91  WS2812B-Mini  [WS2812B-Mini]
LED92  WS2812B-Mini  [WS2812B-Mini]
LED93  WS2812B-Mini  [WS2812B-Mini]
LED94  WS2812B-Mini  [WS2812B-Mini]
LED95  WS2812B-Mini  [WS2812B-Mini]

### Ports
DOUT82 (bidir), DOUT95 (bidir)

### Nets
GND: LED83.3(VSS) LED84.3(VSS) LED85.3(VSS) LED86.3(VSS) LED87.3(VSS) LED88.3(VSS) LED89.3(VSS) LED90.3(VSS) LED91.3(VSS) LED92.3(VSS) LED93.3(VSS) LED94.3(VSS) LED95.3(VSS)
VCC_L2: LED83.1(VDD) LED84.1(VDD) LED85.1(VDD) LED86.1(VDD) LED87.1(VDD) LED88.1(VDD) LED89.1(VDD) LED90.1(VDD) LED91.1(VDD) LED92.1(VDD) LED93.1(VDD) LED94.1(VDD) LED95.1(VDD)
DOUT82: LED83.4(DIN) ; port DOUT82
DOUT83: LED83.2(DOUT) LED84.4(DIN)
DOUT84: LED84.2(DOUT) LED85.4(DIN)
DOUT85: LED85.2(DOUT) LED86.4(DIN)
DOUT86: LED86.2(DOUT) LED87.4(DIN)
DOUT87: LED87.2(DOUT) LED88.4(DIN)
DOUT88: LED88.2(DOUT) LED89.4(DIN)
DOUT89: LED89.2(DOUT) LED90.4(DIN)
DOUT90: LED90.2(DOUT) LED91.4(DIN)
DOUT91: LED91.2(DOUT) LED92.4(DIN)
DOUT92: LED92.2(DOUT) LED93.4(DIN)
DOUT93: LED93.2(DOUT) LED94.4(DIN)
DOUT94: LED94.2(DOUT) LED95.4(DIN)
DOUT95: LED95.2(DOUT) ; port DOUT95

### Library data of the parts
LED83-LED95 = WS2812B-Mini: as LED1 on sheet Ring 1; ComponentLink1Description: LCSC; ComponentLink1URL: *https://lcsc.com/product-detail/Light-Emitting-Diodes-LED_Worldsemi-WS2812B-Mini_C527089.html; Package: SMD,3.5x3.5mm; Parameter 1: *

## Sheet Ring 4_C.SchDoc
size A; DocumentNumber: 12; SheetNumber: 20; SheetTotal: 30
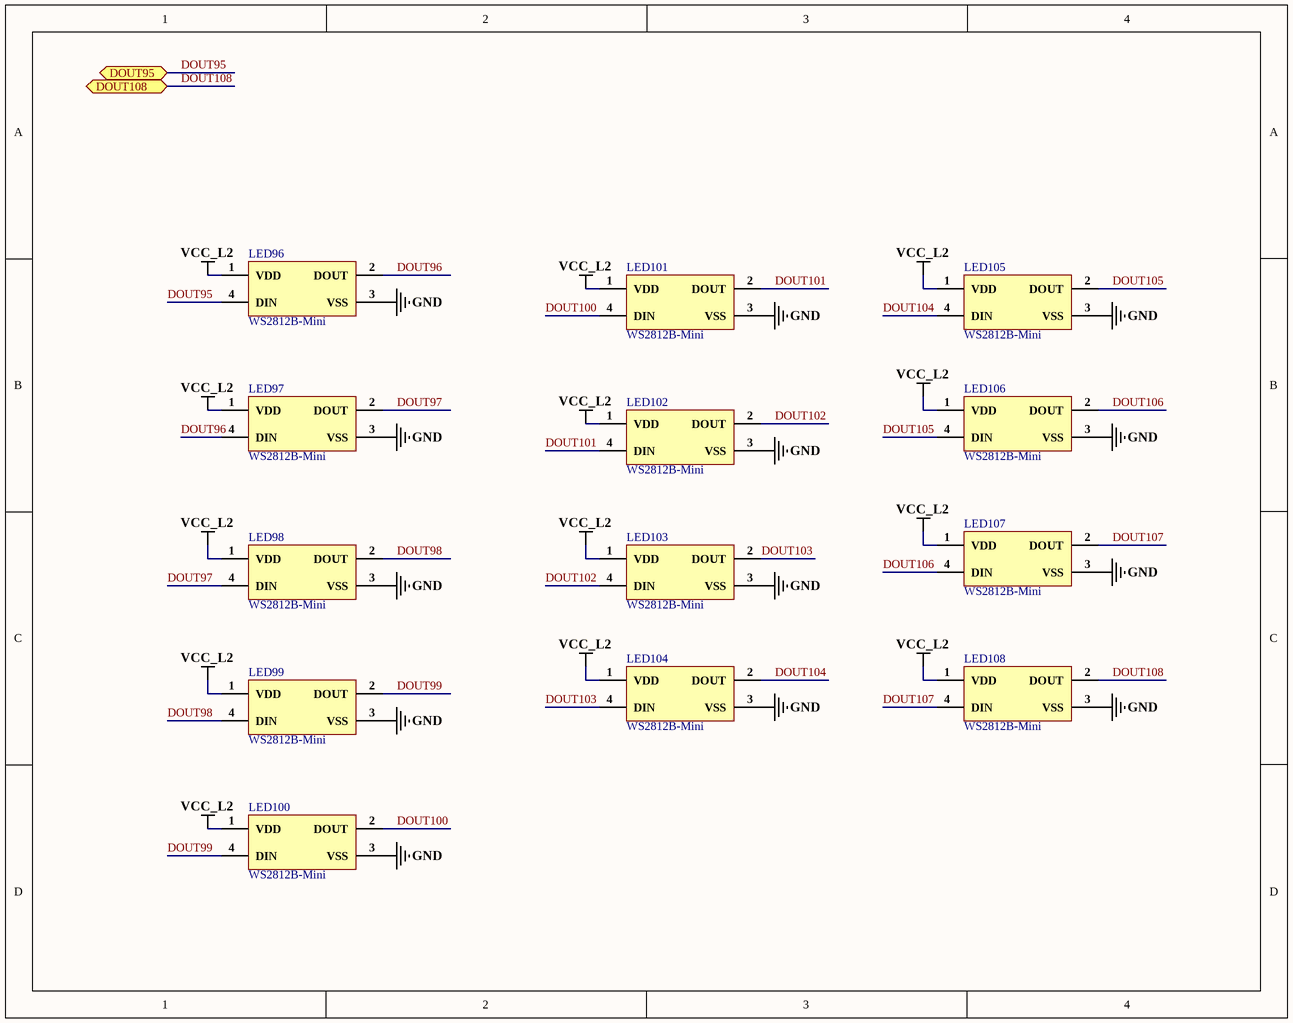
[diagram p13: Ring 4_C.SchDoc]

### Parts
LED96  WS2812B-Mini  [WS2812B-Mini]
LED97  WS2812B-Mini  [WS2812B-Mini]
LED98  WS2812B-Mini  [WS2812B-Mini]
LED99  WS2812B-Mini  [WS2812B-Mini]
LED100  WS2812B-Mini  [WS2812B-Mini]
LED101  WS2812B-Mini  [WS2812B-Mini]
LED102  WS2812B-Mini  [WS2812B-Mini]
LED103  WS2812B-Mini  [WS2812B-Mini]
LED104  WS2812B-Mini  [WS2812B-Mini]
LED105  WS2812B-Mini  [WS2812B-Mini]
LED106  WS2812B-Mini  [WS2812B-Mini]
LED107  WS2812B-Mini  [WS2812B-Mini]
LED108  WS2812B-Mini  [WS2812B-Mini]

### Ports
DOUT95 (bidir), DOUT108 (bidir)

### Nets
GND: LED96.3(VSS) LED97.3(VSS) LED98.3(VSS) LED99.3(VSS) LED100.3(VSS) LED101.3(VSS) LED102.3(VSS) LED103.3(VSS) LED104.3(VSS) LED105.3(VSS) LED106.3(VSS) LED107.3(VSS) LED108.3(VSS)
VCC_L2: LED96.1(VDD) LED97.1(VDD) LED98.1(VDD) LED99.1(VDD) LED100.1(VDD) LED101.1(VDD) LED102.1(VDD) LED103.1(VDD) LED104.1(VDD) LED105.1(VDD) LED106.1(VDD) LED107.1(VDD) LED108.1(VDD)
DOUT95: LED96.4(DIN) ; port DOUT95
DOUT96: LED96.2(DOUT) LED97.4(DIN)
DOUT97: LED97.2(DOUT) LED98.4(DIN)
DOUT98: LED98.2(DOUT) LED99.4(DIN)
DOUT99: LED99.2(DOUT) LED100.4(DIN)
DOUT100: LED100.2(DOUT) LED101.4(DIN)
DOUT101: LED101.2(DOUT) LED102.4(DIN)
DOUT102: LED102.2(DOUT) LED103.4(DIN)
DOUT103: LED103.2(DOUT) LED104.4(DIN)
DOUT104: LED104.2(DOUT) LED105.4(DIN)
DOUT105: LED105.2(DOUT) LED106.4(DIN)
DOUT106: LED106.2(DOUT) LED107.4(DIN)
DOUT107: LED107.2(DOUT) LED108.4(DIN)
DOUT108: LED108.2(DOUT) ; port DOUT108

### Library data of the parts
LED96-LED108 = WS2812B-Mini: as LED1 on sheet Ring 1; ComponentLink1Description: LCSC; ComponentLink1URL: *https://lcsc.com/product-detail/Light-Emitting-Diodes-LED_Worldsemi-WS2812B-Mini_C527089.html; Package: SMD,3.5x3.5mm; Parameter 1: *

## Sheet Ring 5.SchDoc
size A; SheetNumber: 21; SheetTotal: 30
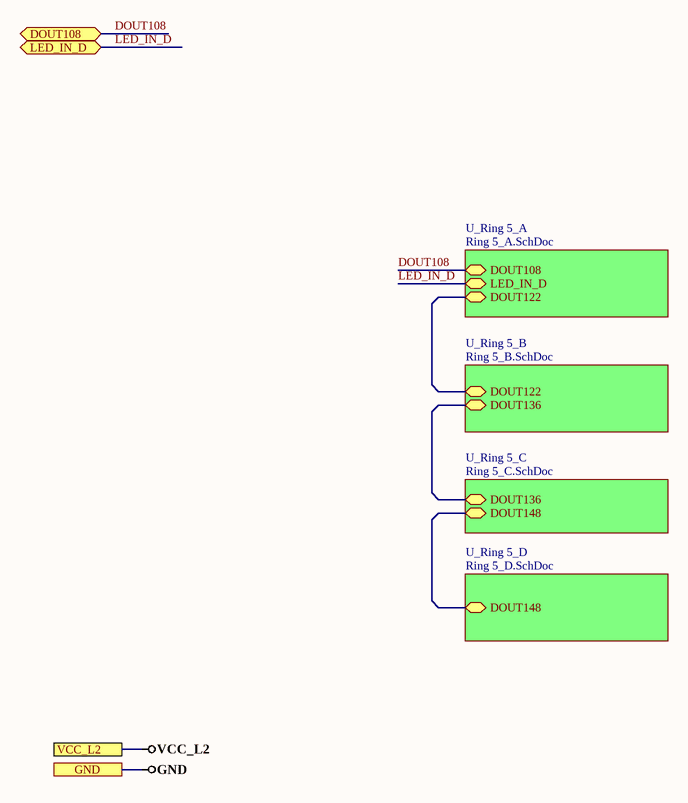
[diagram p14: Ring 5.SchDoc]

### Sub-sheets
U_Ring 5_A = Ring 5_A.SchDoc: DOUT122 (bidir), DOUT108 (bidir), LED_IN_D (bidir)
U_Ring 5_B = Ring 5_B.SchDoc: DOUT122 (bidir), DOUT136 (bidir)
U_Ring 5_C = Ring 5_C.SchDoc: DOUT148 (bidir), DOUT136 (bidir)
U_Ring 5_D = Ring 5_D.SchDoc: DOUT148 (bidir)

### Ports
DOUT108 (bidir), GND, LED_IN_D (bidir), VCC_L2

### Nets
DOUT108: port DOUT108, sheet U_Ring 5_A/DOUT108
DOUT122: sheet U_Ring 5_A/DOUT122, sheet U_Ring 5_B/DOUT122
DOUT136: sheet U_Ring 5_B/DOUT136, sheet U_Ring 5_C/DOUT136
DOUT148: sheet U_Ring 5_C/DOUT148, sheet U_Ring 5_D/DOUT148
LED_IN_D: port LED_IN_D, sheet U_Ring 5_A/LED_IN_D

## Sheet Ring 5_A.SchDoc
size A; DocumentNumber: 13; SheetNumber: 22; SheetTotal: 30
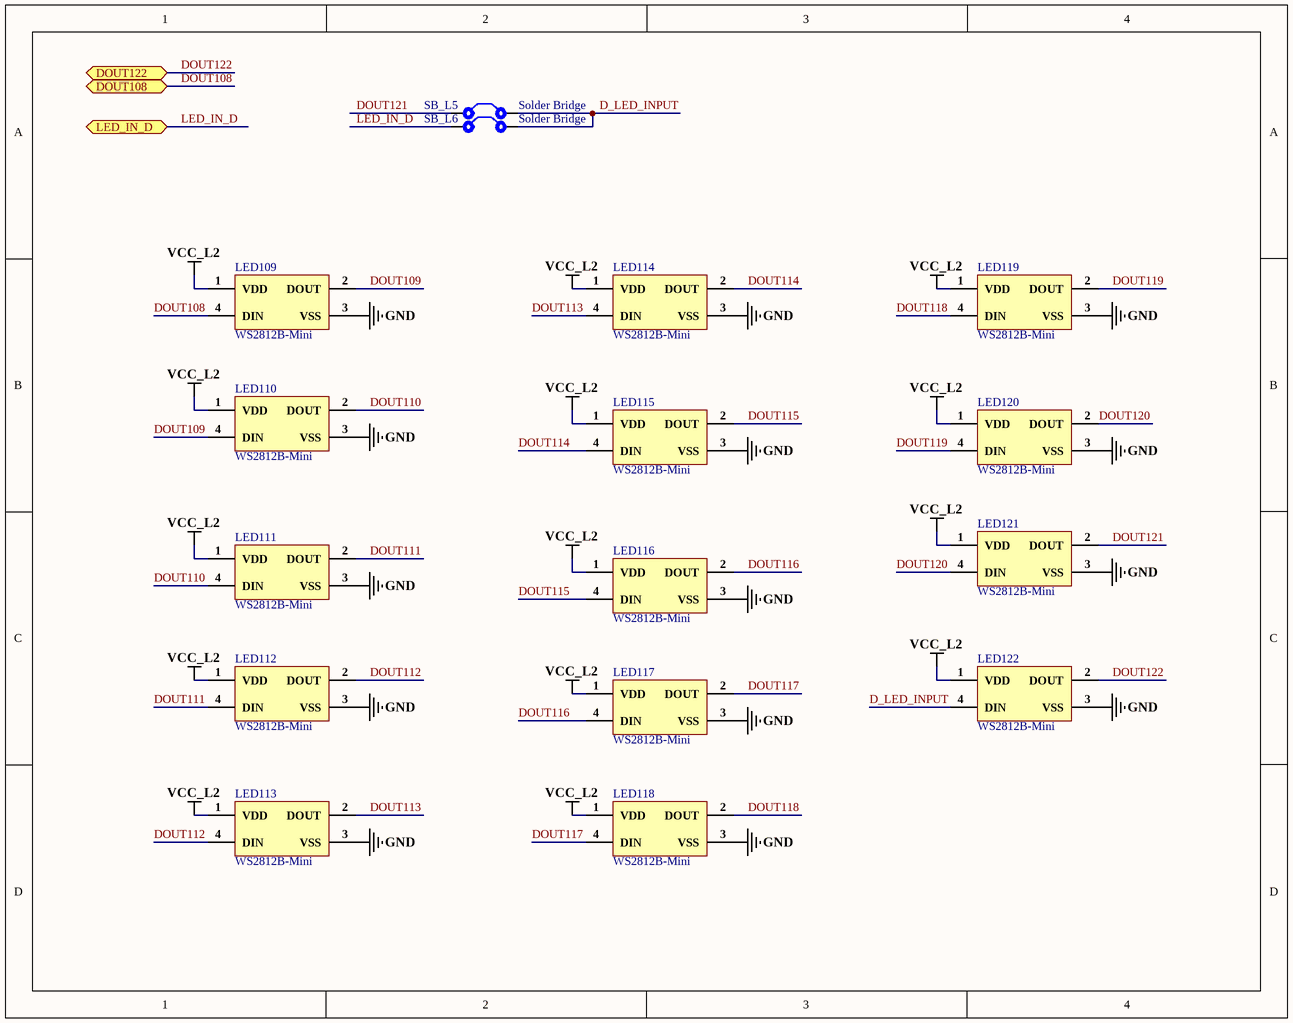
[diagram p15: Ring 5_A.SchDoc]

### Parts
LED109  WS2812B-Mini  [WS2812B-Mini]
LED110  WS2812B-Mini  [WS2812B-Mini]
LED111  WS2812B-Mini  [WS2812B-Mini]
LED112  WS2812B-Mini  [WS2812B-Mini]
LED113  WS2812B-Mini  [WS2812B-Mini]
LED114  WS2812B-Mini  [WS2812B-Mini]
LED115  WS2812B-Mini  [WS2812B-Mini]
LED116  WS2812B-Mini  [WS2812B-Mini]
LED117  WS2812B-Mini  [WS2812B-Mini]
LED118  WS2812B-Mini  [WS2812B-Mini]
LED119  WS2812B-Mini  [WS2812B-Mini]
LED120  WS2812B-Mini  [WS2812B-Mini]
LED121  WS2812B-Mini  [WS2812B-Mini]
LED122  WS2812B-Mini  [WS2812B-Mini]
SB_L5  Solder Bridge  [Solder Bridge]
SB_L6  Solder Bridge  [Solder Bridge]

### Ports
DOUT108 (bidir), DOUT122 (bidir), LED_IN_D (bidir)

### Nets
GND: LED109.3(VSS) LED110.3(VSS) LED111.3(VSS) LED112.3(VSS) LED113.3(VSS) LED114.3(VSS) LED115.3(VSS) LED116.3(VSS) LED117.3(VSS) LED118.3(VSS) LED119.3(VSS) LED120.3(VSS) LED121.3(VSS) LED122.3(VSS)
VCC_L2: LED109.1(VDD) LED110.1(VDD) LED111.1(VDD) LED112.1(VDD) LED113.1(VDD) LED114.1(VDD) LED115.1(VDD) LED116.1(VDD) LED117.1(VDD) LED118.1(VDD) LED119.1(VDD) LED120.1(VDD) LED121.1(VDD) LED122.1(VDD)
D_LED_INPUT: LED122.4(DIN) SB_L5.2 SB_L6.2
DOUT108: LED109.4(DIN) ; port DOUT108
DOUT109: LED109.2(DOUT) LED110.4(DIN)
DOUT110: LED110.2(DOUT) LED111.4(DIN)
DOUT111: LED111.2(DOUT) LED112.4(DIN)
DOUT112: LED112.2(DOUT) LED113.4(DIN)
DOUT113: LED113.2(DOUT) LED114.4(DIN)
DOUT114: LED114.2(DOUT) LED115.4(DIN)
DOUT115: LED115.2(DOUT) LED116.4(DIN)
DOUT116: LED116.2(DOUT) LED117.4(DIN)
DOUT117: LED117.2(DOUT) LED118.4(DIN)
DOUT118: LED118.2(DOUT) LED119.4(DIN)
DOUT119: LED119.2(DOUT) LED120.4(DIN)
DOUT120: LED120.2(DOUT) LED121.4(DIN)
DOUT121: LED121.2(DOUT) SB_L5.1
DOUT122: LED122.2(DOUT) ; port DOUT122
LED_IN_D: SB_L6.1 ; port LED_IN_D

### Library data of the parts
LED109-LED122 = WS2812B-Mini: as LED1 on sheet Ring 1; ComponentLink1Description: LCSC; ComponentLink1URL: *https://lcsc.com/product-detail/Light-Emitting-Diodes-LED_Worldsemi-WS2812B-Mini_C527089.html; Package: SMD,3.5x3.5mm; Parameter 1: *
SB_L5 SB_L6 = Solder Bridge: Solder Bridge ON

## Sheet Ring 5_B.SchDoc
size A; DocumentNumber: 14; SheetNumber: 23; SheetTotal: 30
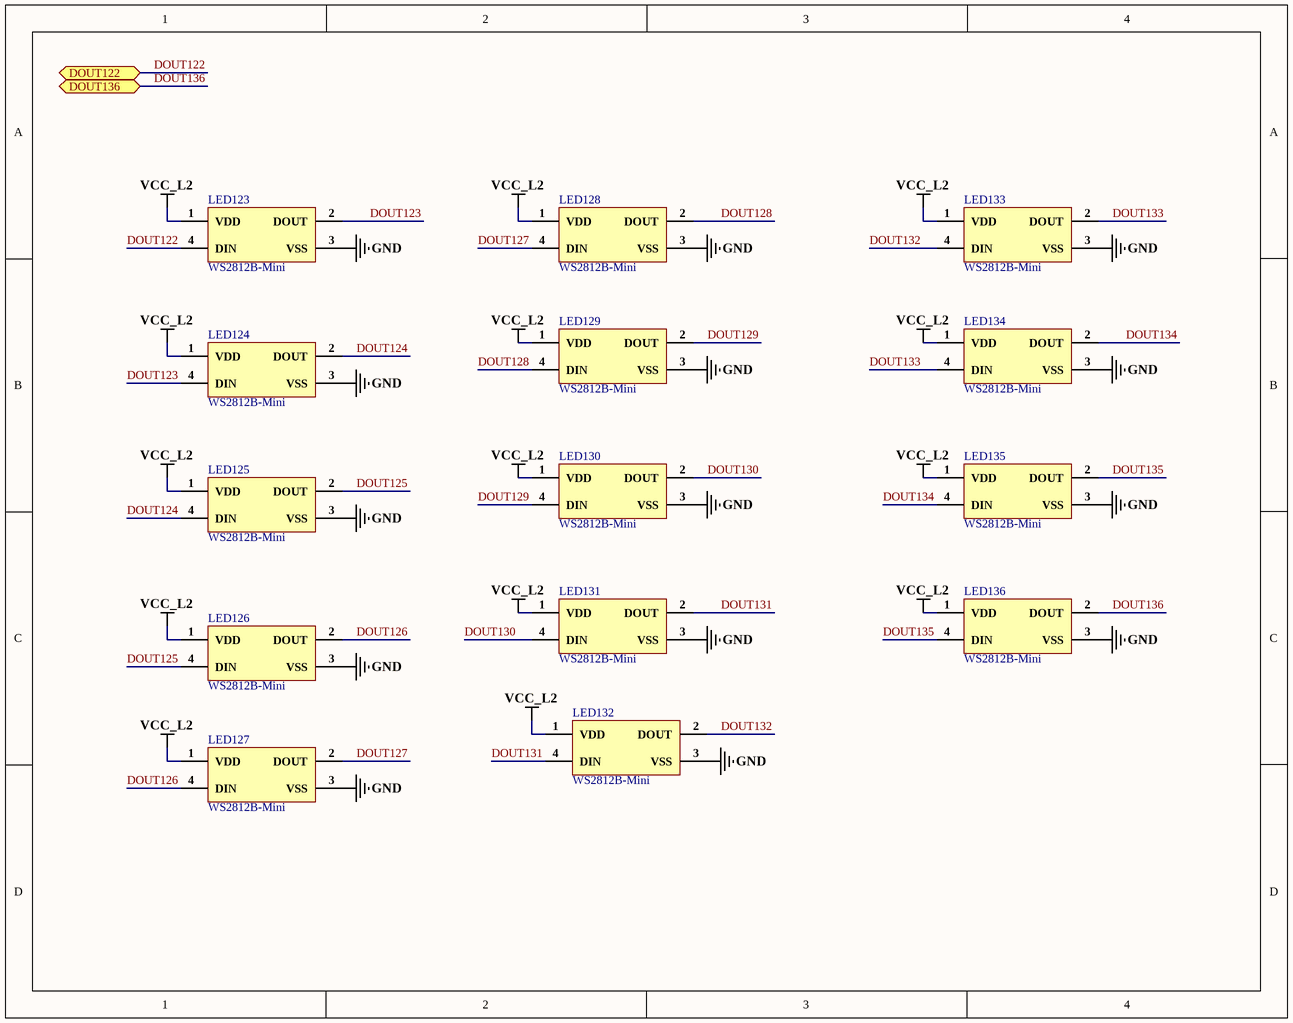
[diagram p16: Ring 5_B.SchDoc]

### Parts
LED123  WS2812B-Mini  [WS2812B-Mini]
LED124  WS2812B-Mini  [WS2812B-Mini]
LED125  WS2812B-Mini  [WS2812B-Mini]
LED126  WS2812B-Mini  [WS2812B-Mini]
LED127  WS2812B-Mini  [WS2812B-Mini]
LED128  WS2812B-Mini  [WS2812B-Mini]
LED129  WS2812B-Mini  [WS2812B-Mini]
LED130  WS2812B-Mini  [WS2812B-Mini]
LED131  WS2812B-Mini  [WS2812B-Mini]
LED132  WS2812B-Mini  [WS2812B-Mini]
LED133  WS2812B-Mini  [WS2812B-Mini]
LED134  WS2812B-Mini  [WS2812B-Mini]
LED135  WS2812B-Mini  [WS2812B-Mini]
LED136  WS2812B-Mini  [WS2812B-Mini]

### Ports
DOUT122 (bidir), DOUT136 (bidir)

### Nets
GND: LED123.3(VSS) LED124.3(VSS) LED125.3(VSS) LED126.3(VSS) LED127.3(VSS) LED128.3(VSS) LED129.3(VSS) LED130.3(VSS) LED131.3(VSS) LED132.3(VSS) LED133.3(VSS) LED134.3(VSS) LED135.3(VSS) LED136.3(VSS)
VCC_L2: LED123.1(VDD) LED124.1(VDD) LED125.1(VDD) LED126.1(VDD) LED127.1(VDD) LED128.1(VDD) LED129.1(VDD) LED130.1(VDD) LED131.1(VDD) LED132.1(VDD) LED133.1(VDD) LED134.1(VDD) LED135.1(VDD) LED136.1(VDD)
DOUT122: LED123.4(DIN) ; port DOUT122
DOUT123: LED123.2(DOUT) LED124.4(DIN)
DOUT124: LED124.2(DOUT) LED125.4(DIN)
DOUT125: LED125.2(DOUT) LED126.4(DIN)
DOUT126: LED126.2(DOUT) LED127.4(DIN)
DOUT127: LED127.2(DOUT) LED128.4(DIN)
DOUT128: LED128.2(DOUT) LED129.4(DIN)
DOUT129: LED129.2(DOUT) LED130.4(DIN)
DOUT130: LED130.2(DOUT) LED131.4(DIN)
DOUT131: LED131.2(DOUT) LED132.4(DIN)
DOUT132: LED132.2(DOUT) LED133.4(DIN)
DOUT133: LED133.2(DOUT) LED134.4(DIN)
DOUT134: LED134.2(DOUT) LED135.4(DIN)
DOUT135: LED135.2(DOUT) LED136.4(DIN)
DOUT136: LED136.2(DOUT) ; port DOUT136

### Library data of the parts
LED123-LED136 = WS2812B-Mini: as LED1 on sheet Ring 1; ComponentLink1Description: LCSC; ComponentLink1URL: *https://lcsc.com/product-detail/Light-Emitting-Diodes-LED_Worldsemi-WS2812B-Mini_C527089.html; Package: SMD,3.5x3.5mm; Parameter 1: *

## Sheet Ring 5_C.SchDoc
size A; DocumentNumber: 15; SheetNumber: 24; SheetTotal: 30
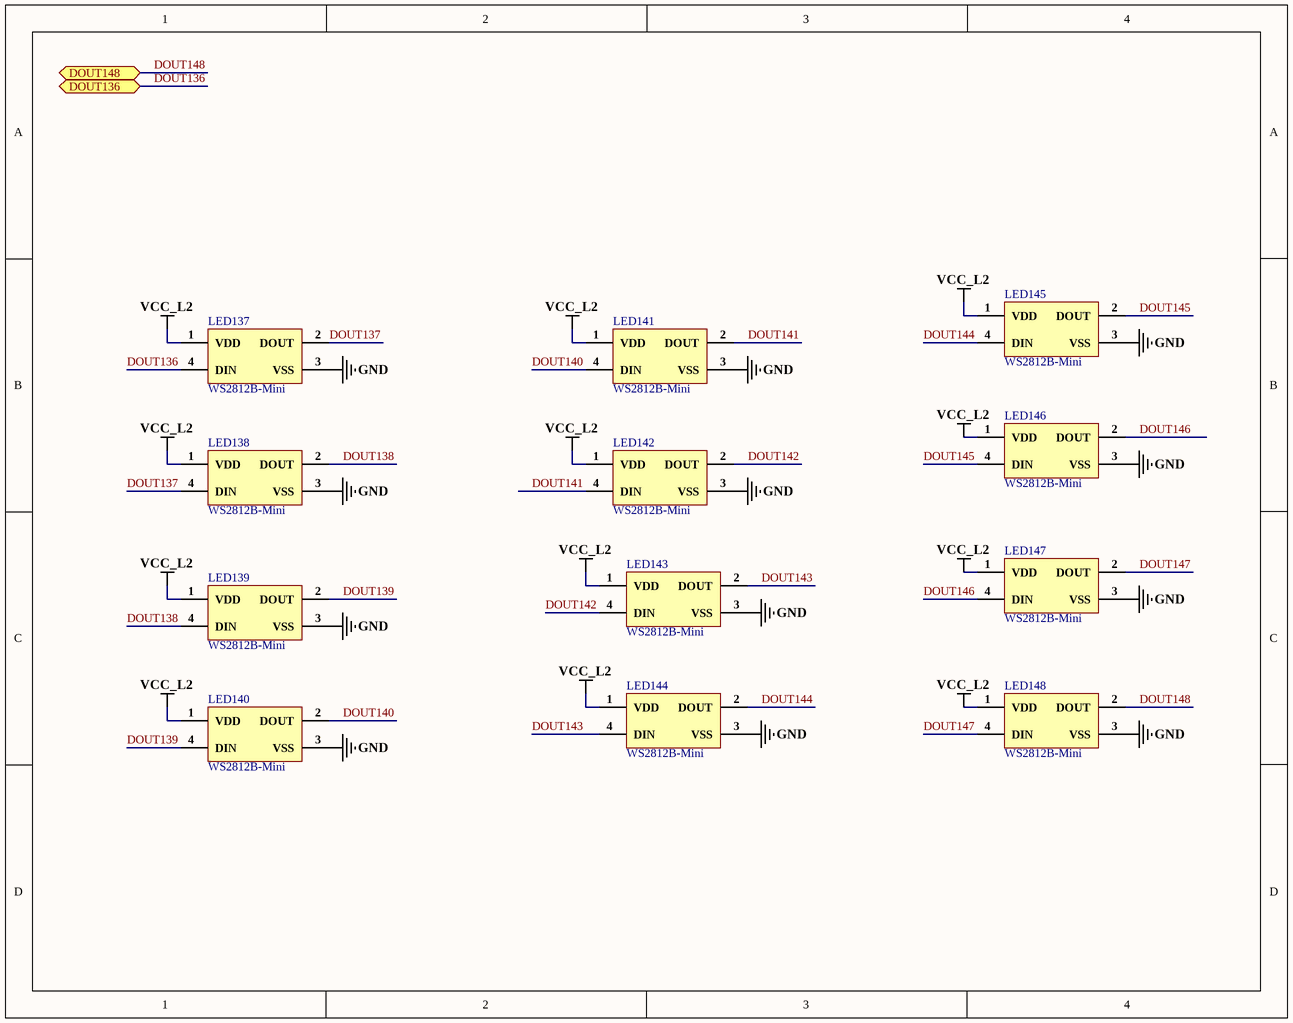
[diagram p17: Ring 5_C.SchDoc]

### Parts
LED137  WS2812B-Mini  [WS2812B-Mini]
LED138  WS2812B-Mini  [WS2812B-Mini]
LED139  WS2812B-Mini  [WS2812B-Mini]
LED140  WS2812B-Mini  [WS2812B-Mini]
LED141  WS2812B-Mini  [WS2812B-Mini]
LED142  WS2812B-Mini  [WS2812B-Mini]
LED143  WS2812B-Mini  [WS2812B-Mini]
LED144  WS2812B-Mini  [WS2812B-Mini]
LED145  WS2812B-Mini  [WS2812B-Mini]
LED146  WS2812B-Mini  [WS2812B-Mini]
LED147  WS2812B-Mini  [WS2812B-Mini]
LED148  WS2812B-Mini  [WS2812B-Mini]

### Ports
DOUT136 (bidir), DOUT148 (bidir)

### Nets
GND: LED137.3(VSS) LED138.3(VSS) LED139.3(VSS) LED140.3(VSS) LED141.3(VSS) LED142.3(VSS) LED143.3(VSS) LED144.3(VSS) LED145.3(VSS) LED146.3(VSS) LED147.3(VSS) LED148.3(VSS)
VCC_L2: LED137.1(VDD) LED138.1(VDD) LED139.1(VDD) LED140.1(VDD) LED141.1(VDD) LED142.1(VDD) LED143.1(VDD) LED144.1(VDD) LED145.1(VDD) LED146.1(VDD) LED147.1(VDD) LED148.1(VDD)
DOUT136: LED137.4(DIN) ; port DOUT136
DOUT137: LED137.2(DOUT) LED138.4(DIN)
DOUT138: LED138.2(DOUT) LED139.4(DIN)
DOUT139: LED139.2(DOUT) LED140.4(DIN)
DOUT140: LED140.2(DOUT) LED141.4(DIN)
DOUT141: LED141.2(DOUT) LED142.4(DIN)
DOUT142: LED142.2(DOUT) LED143.4(DIN)
DOUT143: LED143.2(DOUT) LED144.4(DIN)
DOUT144: LED144.2(DOUT) LED145.4(DIN)
DOUT145: LED145.2(DOUT) LED146.4(DIN)
DOUT146: LED146.2(DOUT) LED147.4(DIN)
DOUT147: LED147.2(DOUT) LED148.4(DIN)
DOUT148: LED148.2(DOUT) ; port DOUT148

### Library data of the parts
LED137-LED148 = WS2812B-Mini: as LED1 on sheet Ring 1; ComponentLink1Description: LCSC; ComponentLink1URL: *https://lcsc.com/product-detail/Light-Emitting-Diodes-LED_Worldsemi-WS2812B-Mini_C527089.html; Package: SMD,3.5x3.5mm; Parameter 1: *

## Sheet Ring 5_D.SchDoc
size A; DocumentNumber: 16; SheetNumber: 25; SheetTotal: 30
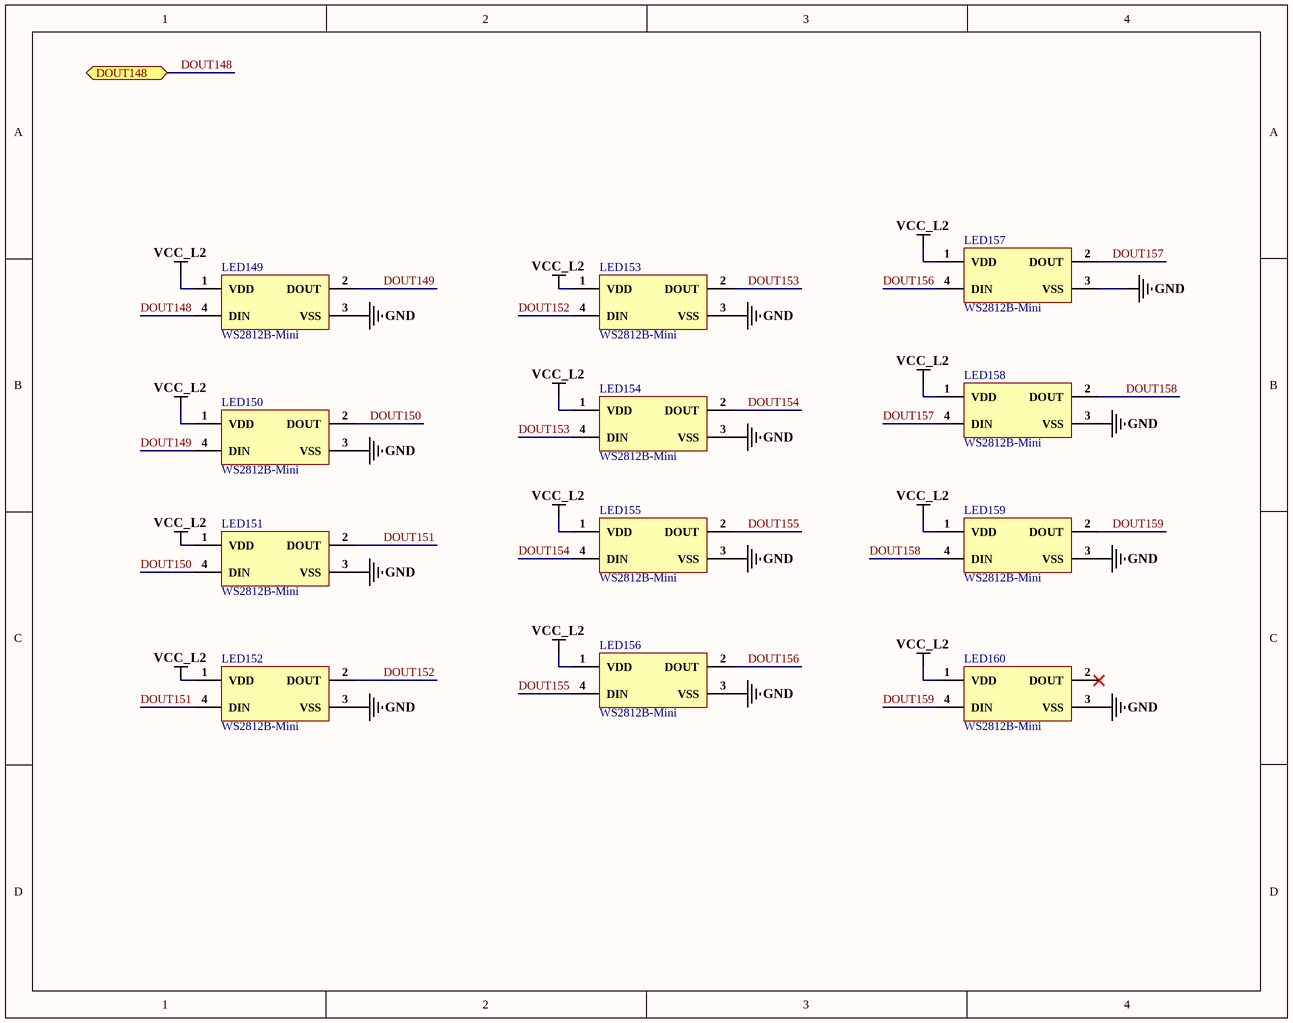
[diagram p18: Ring 5_D.SchDoc]

### Parts
LED149  WS2812B-Mini  [WS2812B-Mini]
LED150  WS2812B-Mini  [WS2812B-Mini]
LED151  WS2812B-Mini  [WS2812B-Mini]
LED152  WS2812B-Mini  [WS2812B-Mini]
LED153  WS2812B-Mini  [WS2812B-Mini]
LED154  WS2812B-Mini  [WS2812B-Mini]
LED155  WS2812B-Mini  [WS2812B-Mini]
LED156  WS2812B-Mini  [WS2812B-Mini]
LED157  WS2812B-Mini  [WS2812B-Mini]
LED158  WS2812B-Mini  [WS2812B-Mini]
LED159  WS2812B-Mini  [WS2812B-Mini]
LED160  WS2812B-Mini  [WS2812B-Mini]

### Ports
DOUT148 (bidir)

### Nets
GND: LED149.3(VSS) LED150.3(VSS) LED151.3(VSS) LED152.3(VSS) LED153.3(VSS) LED154.3(VSS) LED155.3(VSS) LED156.3(VSS) LED157.3(VSS) LED158.3(VSS) LED159.3(VSS) LED160.3(VSS)
VCC_L2: LED149.1(VDD) LED150.1(VDD) LED151.1(VDD) LED152.1(VDD) LED153.1(VDD) LED154.1(VDD) LED155.1(VDD) LED156.1(VDD) LED157.1(VDD) LED158.1(VDD) LED159.1(VDD) LED160.1(VDD)
DOUT148: LED149.4(DIN) ; port DOUT148
DOUT149: LED149.2(DOUT) LED150.4(DIN)
DOUT150: LED150.2(DOUT) LED151.4(DIN)
DOUT151: LED151.2(DOUT) LED152.4(DIN)
DOUT152: LED152.2(DOUT) LED153.4(DIN)
DOUT153: LED153.2(DOUT) LED154.4(DIN)
DOUT154: LED154.2(DOUT) LED155.4(DIN)
DOUT155: LED155.2(DOUT) LED156.4(DIN)
DOUT156: LED156.2(DOUT) LED157.4(DIN)
DOUT157: LED157.2(DOUT) LED158.4(DIN)
DOUT158: LED158.2(DOUT) LED159.4(DIN)
DOUT159: LED159.2(DOUT) LED160.4(DIN)

Not connected (* = marked no-connect by the designer): LED160 2(DOUT)*

### Library data of the parts
LED149-LED160 = WS2812B-Mini: as LED1 on sheet Ring 1; ComponentLink1Description: LCSC; ComponentLink1URL: *https://lcsc.com/product-detail/Light-Emitting-Diodes-LED_Worldsemi-WS2812B-Mini_C527089.html; Package: SMD,3.5x3.5mm; Parameter 1: *

## Sheet Decoup_Cap 1.SchDoc
size A
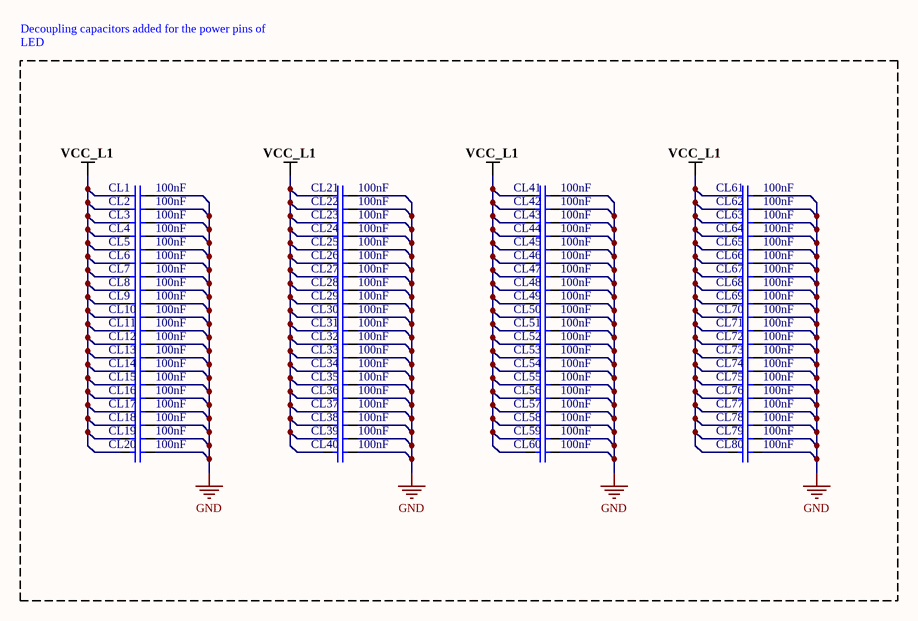
[diagram p19: Decoup_Cap 1.SchDoc]

### Parts
CL1  100nF  [Cap0402]
CL2  100nF  [Cap0402]
CL3  100nF  [Cap0402]
CL4  100nF  [Cap0402]
CL5  100nF  [Cap0402]
CL6  100nF  [Cap0402]
CL7  100nF  [Cap0402]
CL8  100nF  [Cap0402]
CL9  100nF  [Cap0402]
CL10  100nF  [Cap0402]
CL11  100nF  [Cap0402]
CL12  100nF  [Cap0402]
CL13  100nF  [Cap0402]
CL14  100nF  [Cap0402]
CL15  100nF  [Cap0402]
CL16  100nF  [Cap0402]
CL17  100nF  [Cap0402]
CL18  100nF  [Cap0402]
CL19  100nF  [Cap0402]
CL20  100nF  [Cap0402]
CL21  100nF  [Cap0402]
CL22  100nF  [Cap0402]
CL23  100nF  [Cap0402]
CL24  100nF  [Cap0402]
CL25  100nF  [Cap0402]
CL26  100nF  [Cap0402]
CL27  100nF  [Cap0402]
CL28  100nF  [Cap0402]
CL29  100nF  [Cap0402]
CL30  100nF  [Cap0402]
CL31  100nF  [Cap0402]
CL32  100nF  [Cap0402]
CL33  100nF  [Cap0402]
CL34  100nF  [Cap0402]
CL35  100nF  [Cap0402]
CL36  100nF  [Cap0402]
CL37  100nF  [Cap0402]
CL38  100nF  [Cap0402]
CL39  100nF  [Cap0402]
CL40  100nF  [Cap0402]
CL41  100nF  [Cap0402]
CL42  100nF  [Cap0402]
CL43  100nF  [Cap0402]
CL44  100nF  [Cap0402]
CL45  100nF  [Cap0402]
CL46  100nF  [Cap0402]
CL47  100nF  [Cap0402]
CL48  100nF  [Cap0402]
CL49  100nF  [Cap0402]
CL50  100nF  [Cap0402]
CL51  100nF  [Cap0402]
CL52  100nF  [Cap0402]
CL53  100nF  [Cap0402]
CL54  100nF  [Cap0402]
CL55  100nF  [Cap0402]
CL56  100nF  [Cap0402]
CL57  100nF  [Cap0402]
CL58  100nF  [Cap0402]
CL59  100nF  [Cap0402]
CL60  100nF  [Cap0402]
CL61  100nF  [Cap0402]
CL62  100nF  [Cap0402]
CL63  100nF  [Cap0402]
CL64  100nF  [Cap0402]
CL65  100nF  [Cap0402]
CL66  100nF  [Cap0402]
CL67  100nF  [Cap0402]
CL68  100nF  [Cap0402]
CL69  100nF  [Cap0402]
CL70  100nF  [Cap0402]
CL71  100nF  [Cap0402]
CL72  100nF  [Cap0402]
CL73  100nF  [Cap0402]
CL74  100nF  [Cap0402]
CL75  100nF  [Cap0402]
CL76  100nF  [Cap0402]
CL77  100nF  [Cap0402]
CL78  100nF  [Cap0402]
CL79  100nF  [Cap0402]
CL80  100nF  [Cap0402]

### Nets
GND: CL1.1 CL2.1 CL3.1 CL4.1 CL5.1 CL6.1 CL7.1 CL8.1 CL9.1 CL10.1 CL11.1 CL12.1 CL13.1 CL14.1 CL15.1 CL16.1 CL17.1 CL18.1 CL19.1 CL20.1 CL21.1 CL22.1 CL23.1 CL24.1 CL25.1 CL26.1 CL27.1 CL28.1 CL29.1 CL30.1 CL31.1 CL32.1 CL33.1 CL34.1 CL35.1 CL36.1 CL37.1 CL38.1 CL39.1 CL40.1 CL41.1 CL42.1 CL43.1 CL44.1 CL45.1 CL46.1 CL47.1 CL48.1 CL49.1 CL50.1 CL51.1 CL52.1 CL53.1 CL54.1 CL55.1 CL56.1 CL57.1 CL58.1 CL59.1 CL60.1 CL61.1 CL62.1 CL63.1 CL64.1 CL65.1 CL66.1 CL67.1 CL68.1 CL69.1 CL70.1 CL71.1 CL72.1 CL73.1 CL74.1 CL75.1 CL76.1 CL77.1 CL78.1 CL79.1 CL80.1
VCC_L1: CL1.2 CL2.2 CL3.2 CL4.2 CL5.2 CL6.2 CL7.2 CL8.2 CL9.2 CL10.2 CL11.2 CL12.2 CL13.2 CL14.2 CL15.2 CL16.2 CL17.2 CL18.2 CL19.2 CL20.2 CL21.2 CL22.2 CL23.2 CL24.2 CL25.2 CL26.2 CL27.2 CL28.2 CL29.2 CL30.2 CL31.2 CL32.2 CL33.2 CL34.2 CL35.2 CL36.2 CL37.2 CL38.2 CL39.2 CL40.2 CL41.2 CL42.2 CL43.2 CL44.2 CL45.2 CL46.2 CL47.2 CL48.2 CL49.2 CL50.2 CL51.2 CL52.2 CL53.2 CL54.2 CL55.2 CL56.2 CL57.2 CL58.2 CL59.2 CL60.2 CL61.2 CL62.2 CL63.2 CL64.2 CL65.2 CL66.2 CL67.2 CL68.2 CL69.2 CL70.2 CL71.2 CL72.2 CL73.2 CL74.2 CL75.2 CL76.2 CL77.2 CL78.2 CL79.2 CL80.2

### Notes on the sheet
- Decoupling capacitors added for the power pins of LED

### Library data of the parts
CL1-CL80 = CC0402KRX7R8BB104: Cap Ceramic 0.1uF 25V X7R 10% SMD 0402 125C Paper T/R; Manufacturer: Yageo; Dissipation Factor: 3.5%; Supplier 1: Digi-Key; Manufacturer Part Number: CC0402KRX7R8BB104; RoHS: Yes; Category: Ceramic Capacitors; Stock 1: 1841009; Pricing 1: 1=0.10000, 10=0.03100, 50=0.01700, 100=0.01390, 500=0.00990, 1000=0.00777, 2500=0.00707, 5000=0.00650 (USD); Mount: Surface Mount; Case/Package: 0402; Case Code (Imperial): 0402; Case Code (Metric): 1005; Min Operating Temperature: -55°C; Max Operating Temperature: 125°C; Tolerance: 10%; Capacitance: 100nF; Dielectric: X7R; Voltage Rating: 25V; Voltage Rating (DC): 25V; Packaging: Tape and Reel; Termination: SMD/SMT; Resistor Type: Ceramic; Length: 1mm; Width: 0.02inch; Height: 0.5mm; Thickness: 0.022inch; Depth: 0.5mm; Radiation Hardening: No; Lead Free: Lead Free; Halogen Free: Halogen Free; ComponentLink1URL: https://datasheet.ciiva.com/11464/upy-gphc-x7r-6-3v-to-50v-8-11464889.pdf?src-supplier=Avnet; ComponentLink1Description: https://datasheet.ciiva.com/11464/upy-gphc-x7r-6-3v-to-50v-8-11464889.pdf?src-supplier=Avnet; ComponentLink2URL: https://datasheet.ciiva.com/13210/upy-gphc-x7r-6-3v-to-50v-8-12304-13210908.pdf?src-supplier=Mouser; ComponentLink2Description: https://datasheet.ciiva.com/13210/upy-gphc-x7r-6-3v-to-50v-8-12304-13210908.pdf?src-supplier=Mouser; ComponentLink3URL: https://datasheet.ciiva.com/17437/upy-gphc-x7r-6-3v-to-50v-8-17437357.pdf?src-supplier=Avnet+Europe; ComponentLink3Description: https://datasheet.ciiva.com/17437/upy-gphc-x7r-6-3v-to-50v-8-17437357.pdf?src-supplier=Avnet+Europe; Supplier Part Number 1: 311-2077-1-ND

## Sheet Decoup_Cap 2.SchDoc
size A
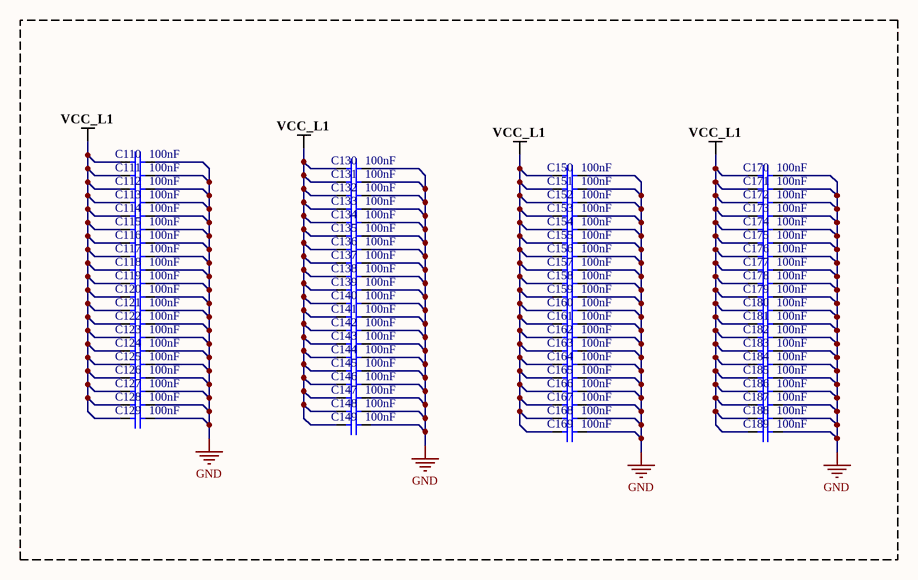
[diagram p20: Decoup_Cap 2.SchDoc]

### Parts
C110  100nF  [Cap0402]
C111  100nF  [Cap0402]
C112  100nF  [Cap0402]
C113  100nF  [Cap0402]
C114  100nF  [Cap0402]
C115  100nF  [Cap0402]
C116  100nF  [Cap0402]
C117  100nF  [Cap0402]
C118  100nF  [Cap0402]
C119  100nF  [Cap0402]
C120  100nF  [Cap0402]
C121  100nF  [Cap0402]
C122  100nF  [Cap0402]
C123  100nF  [Cap0402]
C124  100nF  [Cap0402]
C125  100nF  [Cap0402]
C126  100nF  [Cap0402]
C127  100nF  [Cap0402]
C128  100nF  [Cap0402]
C129  100nF  [Cap0402]
C130  100nF  [Cap0402]
C131  100nF  [Cap0402]
C132  100nF  [Cap0402]
C133  100nF  [Cap0402]
C134  100nF  [Cap0402]
C135  100nF  [Cap0402]
C136  100nF  [Cap0402]
C137  100nF  [Cap0402]
C138  100nF  [Cap0402]
C139  100nF  [Cap0402]
C140  100nF  [Cap0402]
C141  100nF  [Cap0402]
C142  100nF  [Cap0402]
C143  100nF  [Cap0402]
C144  100nF  [Cap0402]
C145  100nF  [Cap0402]
C146  100nF  [Cap0402]
C147  100nF  [Cap0402]
C148  100nF  [Cap0402]
C149  100nF  [Cap0402]
C150  100nF  [Cap0402]
C151  100nF  [Cap0402]
C152  100nF  [Cap0402]
C153  100nF  [Cap0402]
C154  100nF  [Cap0402]
C155  100nF  [Cap0402]
C156  100nF  [Cap0402]
C157  100nF  [Cap0402]
C158  100nF  [Cap0402]
C159  100nF  [Cap0402]
C160  100nF  [Cap0402]
C161  100nF  [Cap0402]
C162  100nF  [Cap0402]
C163  100nF  [Cap0402]
C164  100nF  [Cap0402]
C165  100nF  [Cap0402]
C166  100nF  [Cap0402]
C167  100nF  [Cap0402]
C168  100nF  [Cap0402]
C169  100nF  [Cap0402]
C170  100nF  [Cap0402]
C171  100nF  [Cap0402]
C172  100nF  [Cap0402]
C173  100nF  [Cap0402]
C174  100nF  [Cap0402]
C175  100nF  [Cap0402]
C176  100nF  [Cap0402]
C177  100nF  [Cap0402]
C178  100nF  [Cap0402]
C179  100nF  [Cap0402]
C180  100nF  [Cap0402]
C181  100nF  [Cap0402]
C182  100nF  [Cap0402]
C183  100nF  [Cap0402]
C184  100nF  [Cap0402]
C185  100nF  [Cap0402]
C186  100nF  [Cap0402]
C187  100nF  [Cap0402]
C188  100nF  [Cap0402]
C189  100nF  [Cap0402]

### Nets
GND: C110.1 C111.1 C112.1 C113.1 C114.1 C115.1 C116.1 C117.1 C118.1 C119.1 C120.1 C121.1 C122.1 C123.1 C124.1 C125.1 C126.1 C127.1 C128.1 C129.1 C130.1 C131.1 C132.1 C133.1 C134.1 C135.1 C136.1 C137.1 C138.1 C139.1 C140.1 C141.1 C142.1 C143.1 C144.1 C145.1 C146.1 C147.1 C148.1 C149.1 C150.1 C151.1 C152.1 C153.1 C154.1 C155.1 C156.1 C157.1 C158.1 C159.1 C160.1 C161.1 C162.1 C163.1 C164.1 C165.1 C166.1 C167.1 C168.1 C169.1 C170.1 C171.1 C172.1 C173.1 C174.1 C175.1 C176.1 C177.1 C178.1 C179.1 C180.1 C181.1 C182.1 C183.1 C184.1 C185.1 C186.1 C187.1 C188.1 C189.1
VCC_L1: C110.2 C111.2 C112.2 C113.2 C114.2 C115.2 C116.2 C117.2 C118.2 C119.2 C120.2 C121.2 C122.2 C123.2 C124.2 C125.2 C126.2 C127.2 C128.2 C129.2 C130.2 C131.2 C132.2 C133.2 C134.2 C135.2 C136.2 C137.2 C138.2 C139.2 C140.2 C141.2 C142.2 C143.2 C144.2 C145.2 C146.2 C147.2 C148.2 C149.2 C150.2 C151.2 C152.2 C153.2 C154.2 C155.2 C156.2 C157.2 C158.2 C159.2 C160.2 C161.2 C162.2 C163.2 C164.2 C165.2 C166.2 C167.2 C168.2 C169.2 C170.2 C171.2 C172.2 C173.2 C174.2 C175.2 C176.2 C177.2 C178.2 C179.2 C180.2 C181.2 C182.2 C183.2 C184.2 C185.2 C186.2 C187.2 C188.2 C189.2

### Library data of the parts
C110-C189 = CC0402KRX7R8BB104: CAP CER 0.1UF 25V X7R 0402; Manufacturer: Yageo; Tolerance: 10%; Dissipation Factor: 3.5%; Supplier 1: Digi-Key; Manufacturer Part Number: CC0402KRX7R8BB104; RoHS: Yes; Category: Ceramic Capacitors; Stock 1: 1841009; Pricing 1: 1=0.10000, 10=0.03100, 50=0.01700, 100=0.01390, 500=0.00990, 1000=0.00777, 2500=0.00707, 5000=0.00650 (USD); Mount: Surface Mount; Case/Package: 0402; Case Code (Imperial): 0402; Case Code (Metric): 1005; Min Operating Temperature: -55°C; Max Operating Temperature: 125°C; Capacitance: 100nF; Dielectric: X7R; Voltage Rating: 25V; Voltage Rating (DC): 25V; Packaging: Tape and Reel; Termination: SMD/SMT; Resistor Type: Ceramic; Length: 1mm; Width: 0.02inch; Height: 0.5mm; Thickness: 0.022inch; Depth: 0.5mm; Radiation Hardening: No; Lead Free: Lead Free; Halogen Free: Halogen Free; ComponentLink1URL: https://datasheet.ciiva.com/11464/upy-gphc-x7r-6-3v-to-50v-8-11464889.pdf?src-supplier=Avnet; ComponentLink1Description: https://datasheet.ciiva.com/11464/upy-gphc-x7r-6-3v-to-50v-8-11464889.pdf?src-supplier=Avnet; ComponentLink2URL: https://datasheet.ciiva.com/13210/upy-gphc-x7r-6-3v-to-50v-8-12304-13210908.pdf?src-supplier=Mouser; ComponentLink2Description: https://datasheet.ciiva.com/13210/upy-gphc-x7r-6-3v-to-50v-8-12304-13210908.pdf?src-supplier=Mouser; ComponentLink3URL: https://datasheet.ciiva.com/17437/upy-gphc-x7r-6-3v-to-50v-8-17437357.pdf?src-supplier=Avnet+Europe; ComponentLink3Description: https://datasheet.ciiva.com/17437/upy-gphc-x7r-6-3v-to-50v-8-17437357.pdf?src-supplier=Avnet+Europe; Supplier Part Number 1: 311-2077-1-ND

## Sheet Power Section.SchDoc
size A; DocumentNumber: 2; SheetNumber: 26; SheetTotal: 30
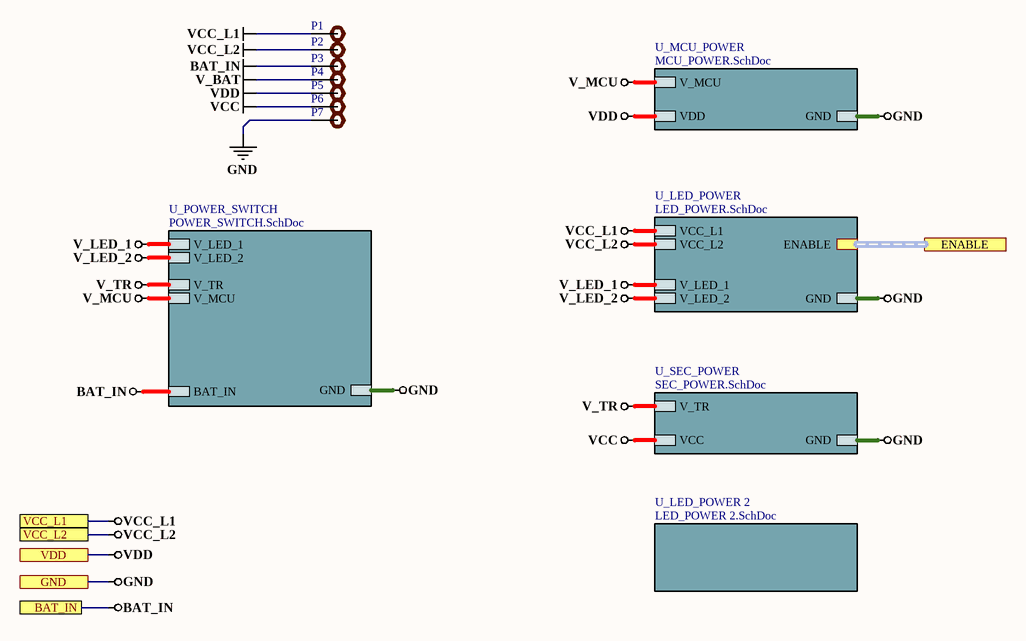
[diagram p21: Power Section.SchDoc]

### Parts
P1  Test Point  [TEST POINT]  (value not drawn)
P2  Test Point  [TEST POINT]  (value not drawn)
P3  Test Point  [TEST POINT]  (value not drawn)
P4  Test Point  [TEST POINT]  (value not drawn)
P5  Test Point  [TEST POINT]  (value not drawn)
P6  Test Point  [TEST POINT]  (value not drawn)
P7  Test Point  [TEST POINT]  (value not drawn)

### Sub-sheets
U_LED_POWER = LED_POWER.SchDoc: VCC_L2, VCC_L1, GND, V_LED_2, V_LED_1, ENABLE (harness Harness_2)
U_LED_POWER 2 = LED_POWER 2.SchDoc: no entries
U_MCU_POWER = MCU_POWER.SchDoc: VDD, V_MCU, GND
U_POWER_SWITCH = POWER_SWITCH.SchDoc: V_LED_1, V_LED_2, GND, V_TR, V_MCU, BAT_IN
U_SEC_POWER = SEC_POWER.SchDoc: VCC, V_TR, GND

### Ports
BAT_IN, ENABLE (harness Harness_2), GND, VCC_L1, VCC_L2, VDD

### Nets
BAT_IN: P3.1 ; port BAT_IN, sheet U_POWER_SWITCH/BAT_IN
GND: P7.1 ; port GND, sheet U_MCU_POWER/GND, sheet U_LED_POWER/GND, sheet U_POWER_SWITCH/GND, sheet U_SEC_POWER/GND
V_BAT: P4.1
V_LED_1: sheet U_LED_POWER/V_LED_1, sheet U_POWER_SWITCH/V_LED_1  [project net VIN]
V_LED_2: sheet U_LED_POWER/V_LED_2, sheet U_POWER_SWITCH/V_LED_2  [project net VIN#]
V_MCU: sheet U_MCU_POWER/V_MCU, sheet U_POWER_SWITCH/V_MCU
V_TR: sheet U_POWER_SWITCH/V_TR, sheet U_SEC_POWER/V_TR
VCC: P6.1 ; sheet U_SEC_POWER/VCC
VCC_L1: P1.1 ; port VCC_L1, sheet U_LED_POWER/VCC_L1
VCC_L2: P2.1 ; port VCC_L2, sheet U_LED_POWER/VCC_L2
VDD: P5.1 ; port VDD, sheet U_MCU_POWER/VDD

### Buses and harness runs
harness port ENABLE = sheet U_LED_POWER/ENABLE

### Library data of the parts
P1-P7 = TEST POINT: Test Point ON

## Sheet MCU_POWER.SchDoc
size A; SheetNumber: 28; SheetTotal: 30
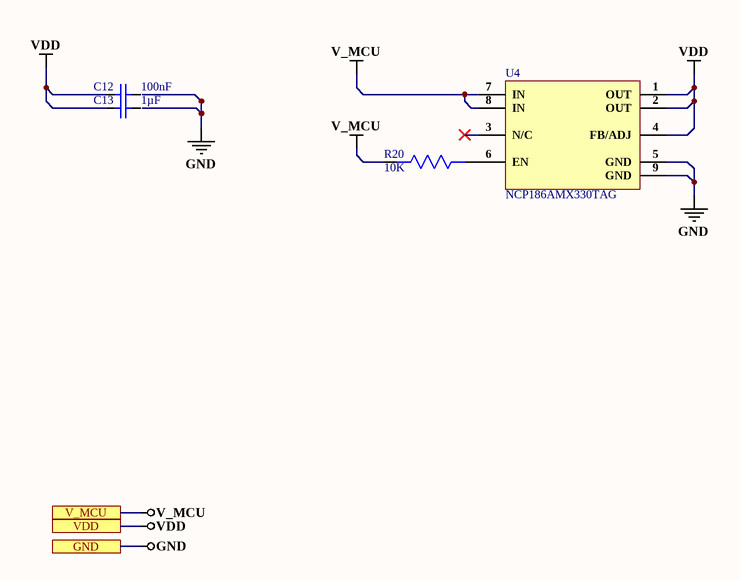
[diagram p22: MCU_POWER.SchDoc]

### Parts
C12  100nF  [Cap0402]
C13  1µF  [Cap0402]
R20  10K  [Res-0201]
U4  NCP186AMX330TAG  [NCP186AMX330TAG]

### Ports
GND, V_MCU, VDD

### Nets
GND: U4.5(GND) U4.9(GND) ; port GND
V_MCU: R20.2 U4.7(IN) U4.8(IN) ; port V_MCU
VDD: C12.2 C13.2 U4.1(OUT) U4.2(OUT) U4.4(FB/ADJ) ; port VDD
NetR20_1: R20.1 U4.6(EN)

Not connected (* = marked no-connect by the designer): C12 1; C13 1; U4 3(N/C)*

### Library data of the parts
C12 = CC0402KRX7R8BB104: as C110 on sheet Decoup_Cap 2; Supplier 1: Digi-Key; Manufacturer Part Number: CC0402KRX7R8BB104; RoHS: Yes; Category: Ceramic Capacitors; Stock 1: 1841009; Pricing 1: 1=0.10000, 10=0.03100, 50=0.01700, 100=0.01390, 500=0.00990, 1000=0.00777, 2500=0.00707, 5000=0.00650 (USD); Mount: Surface Mount; Case/Package: 0402; Case Code (Imperial): 0402; Case Code (Metric): 1005; Min Operating Temperature: -55°C; Max Operating Temperature: 125°C; Capacitance: 100nF; Dielectric: X7R; Voltage Rating: 25V; Voltage Rating (DC): 25V; Packaging: Tape and Reel; Termination: SMD/SMT; Resistor Type: Ceramic; Length: 1mm; Width: 0.02inch; Height: 0.5mm; Thickness: 0.022inch; Depth: 0.5mm; Radiation Hardening: No; Lead Free: Lead Free; Halogen Free: Halogen Free; ComponentLink1URL: https://datasheet.ciiva.com/11464/upy-gphc-x7r-6-3v-to-50v-8-11464889.pdf?src-supplier=Avnet; ComponentLink1Description: https://datasheet.ciiva.com/11464/upy-gphc-x7r-6-3v-to-50v-8-11464889.pdf?src-supplier=Avnet; ComponentLink2URL: https://datasheet.ciiva.com/13210/upy-gphc-x7r-6-3v-to-50v-8-12304-13210908.pdf?src-supplier=Mouser; ComponentLink2Description: https://datasheet.ciiva.com/13210/upy-gphc-x7r-6-3v-to-50v-8-12304-13210908.pdf?src-supplier=Mouser; ComponentLink3URL: https://datasheet.ciiva.com/17437/upy-gphc-x7r-6-3v-to-50v-8-17437357.pdf?src-supplier=Avnet+Europe; ComponentLink3Description: https://datasheet.ciiva.com/17437/upy-gphc-x7r-6-3v-to-50v-8-17437357.pdf?src-supplier=Avnet+Europe; Supplier Part Number 1: 311-2077-1-ND
C13 = GRM155R61E105KA12D: CAP CER 1UF 25V X5R 0402; Manufacturer: Murata; Material: Ceramic; Tolerance: 10%; Supplier 1: Digi-Key; Manufacturer Part Number: GRM155R61E105KA12D; RoHS: Yes; Category: Ceramic Capacitors; Stock 1: 961231; Pricing 1: 1=0.11000, 10=0.08000, 50=0.04360, 100=0.03560, 500=0.02542, 1000=0.01997, 2500=0.01815, 5000=0.01670 (USD); Mount: Surface Mount; Case/Package: 0402; Case Code (Metric): 1005; Case Code (Imperial): 0402; Weight: 0.000212oz; Min Operating Temperature: -55°C; Max Operating Temperature: 85°C; Capacitance: 1uF; Voltage Rating: 25V; Packaging: Tape and Reel; Dielectric: X5R; Voltage: 25V; Termination: SMD/SMT; Voltage Rating (DC): 25V; Package Quantity: 10000; Series: GRM; Length: 1mm; Width: 0.5mm; Height: 0.5mm; Thickness: 0.022inch; Depth: 0.5mm; REACH SVHC: No SVHC; Lead Free: Lead Free; ComponentLink1URL: https://datasheet.ciiva.com/22732/1666664-22732122.pdf?src-supplier=Element14; ComponentLink1Description: https://datasheet.ciiva.com/22732/1666664-22732122.pdf?src-supplier=Element14; ComponentLink2URL: https://datasheet.ciiva.com/7719/1666664-7719006.pdf?src-supplier=Element14; ComponentLink2Description: https://datasheet.ciiva.com/7719/1666664-7719006.pdf?src-supplier=Element14; Supplier Part Number 1: 490-10017-1-ND
R20 = RC0201FR-0710KL: GENERAL 0201 11% REEL (7INCH); Manufacturer: Yageo; Temperature Coefficient: 200ppm/°C; Resistance: 10kR; Tolerance: 1%; Max Power Dissipation: 50mW; Working Voltage: 25V; Supplier 1: Digi-Key; Manufacturer Part Number: RC0201FR-0710KL; RoHS: Yes; Category: Chip SMD Resistors; Stock 1: 6892350; Pricing 1: 1=0.10000, 10=0.03600, 100=0.01480, 1000=0.00665, 2500=0.00577, 5000=0.00477 (USD); Case/Package: 0201; Number of Pins: 2; Contact Plating: Tin,Matte; Weight: 6E-06oz; Case Code (Imperial): 0201; Case Code (Metric): 0603; Min Operating Temperature: -55°C; Max Operating Temperature: 125°C; Resistor Type: Thick Film; Features: Moisture Resistant; Termination: SMD/SMT; Number of Terminations: 2; Power Rating: 50mW; Voltage Rating: 25V; Packaging: Tape and Reel; Package Quantity: 1; Voltage Rating (DC): 25V; Length: 0.6mm; Width: 0.3mm; Height: 0.01inch; Depth: 0.3mm; Radiation Hardening: No; REACH SVHC: No SVHC; Military Standard: Not; Lead Free: Lead Free; ComponentLink1URL: https://datasheet.ciiva.com/2467/pyu-r-int-thick-7-2467109.pdf?src-supplier=Digi-Key; ComponentLink1Description: https://datasheet.ciiva.com/2467/pyu-r-int-thick-7-2467109.pdf?src-supplier=Digi-Key; ComponentLink2URL: https://datasheet.ciiva.com/2467/pyu-r-int-thick-7-2467110.pdf?src-supplier=Digi-Key; ComponentLink2Description: https://datasheet.ciiva.com/2467/pyu-r-int-thick-7-2467110.pdf?src-supplier=Digi-Key; ComponentLink3URL: https://datasheet.ciiva.com/2467/pyu-r-int-thick-7-2467111.pdf?src-supplier=Digi-Key; ComponentLink3Description: https://datasheet.ciiva.com/2467/pyu-r-int-thick-7-2467111.pdf?src-supplier=Digi-Key; ComponentLink4URL: https://datasheet.ciiva.com/7660/1421516-7660807.pdf?src-supplier=Element14; ComponentLink4Description: https://datasheet.ciiva.com/7660/1421516-7660807.pdf?src-supplier=Element14; ComponentLink5URL: https://datasheet.ciiva.com/8891/pyu-rc0201-51-rohs-l-8-8891384.pdf?src-supplier=Avnet; ComponentLink5Description: https://datasheet.ciiva.com/8891/pyu-rc0201-51-rohs-l-8-8891384.pdf?src-supplier=Avnet; ComponentLink6URL: https://datasheet.ciiva.com/28405/pyu-rc0201-51-rohs-l-8-28405609.pdf?src-supplier=Avnet+Europe; ComponentLink6Description: https://datasheet.ciiva.com/28405/pyu-rc0201-51-rohs-l-8-28405609.pdf?src-supplier=Avnet+Europe; ComponentLink7URL: https://datasheet.ciiva.com/26829/getdatasheetpartid-421074-26829851.pdf?src-supplier=Verical; ComponentLink7Description: https://datasheet.ciiva.com/26829/getdatasheetpartid-421074-26829851.pdf?src-supplier=Verical; ComponentLink8URL: https://datasheet.ciiva.com/46391/1421516-46391339.pdf?src-supplier=Element14; ComponentLink8Description: https://datasheet.ciiva.com/46391/1421516-46391339.pdf?src-supplier=Element14; ComponentLink9URL: https://datasheet.ciiva.com/16855/pyu-rc0201-51-rohs-l-8-16855789.pdf?src-supplier=Avnet+Europe; ComponentLink9Description: https://datasheet.ciiva.com/16855/pyu-rc0201-51-rohs-l-8-16855789.pdf?src-supplier=Avnet+Europe; Supplier Part Number 1: 311-10.0KMCT-ND
U4 = NCP186AMX330TAG: IC REG LINEAR 3.3V 1A 8XDFN; Manufacturer: ON Semiconductor; Dropout Voltage: 95mV; Number of Regulators: 1; Min Current Limit: 1.1A; Supplier 1: Digi-Key; Manufacturer Part Number: NCP186AMX330TAG; Stock 1: 5995; Pricing 1: 1=0.48, 10=0.39, 25=0.3564, 100=0.2405, 250=0.199, 500=0.18242, 1000=0.13682 (USD); Mount: Surface Mount; Number of Pins: 8; Min Operating Temperature: -40°C; Max Operating Temperature: 125°C; Packaging: Tape and Reel; Output Voltage: 3.3V; Output Current: 1A; Lead Free: Lead Free; ComponentLink1URL: http://www.farnell.com/datasheets/2236905.pdf?src-supplier=Farnell; ComponentLink1Description: http://www.farnell.com/datasheets/2236905.pdf?src-supplier=Farnell; ComponentLink2URL: http://www.farnell.com/datasheets/2236905.pdf?src-supplier=Newark; ComponentLink2Description: http://www.farnell.com/datasheets/2236905.pdf?src-supplier=Newark; ComponentLink3URL: http://www.onsemi.com/pub/Collateral/NCP186-D.PDF?src-supplier=Digi-Key; ComponentLink3Description: http://www.onsemi.com/pub/Collateral/NCP186-D.PDF?src-supplier=Digi-Key; ComponentLink4URL: https://www.onsemi.com/pub/Collateral/NCP186-D.PDF?src-supplier=Digi-Key; ComponentLink4Description: https://www.onsemi.com/pub/Collateral/NCP186-D.PDF?src-supplier=Digi-Key; Supplier Part Number 1: NCP186AMX330TAGOSCT-ND